# Altium project MC-IMX6UL-DK v1.1.PrjPcb
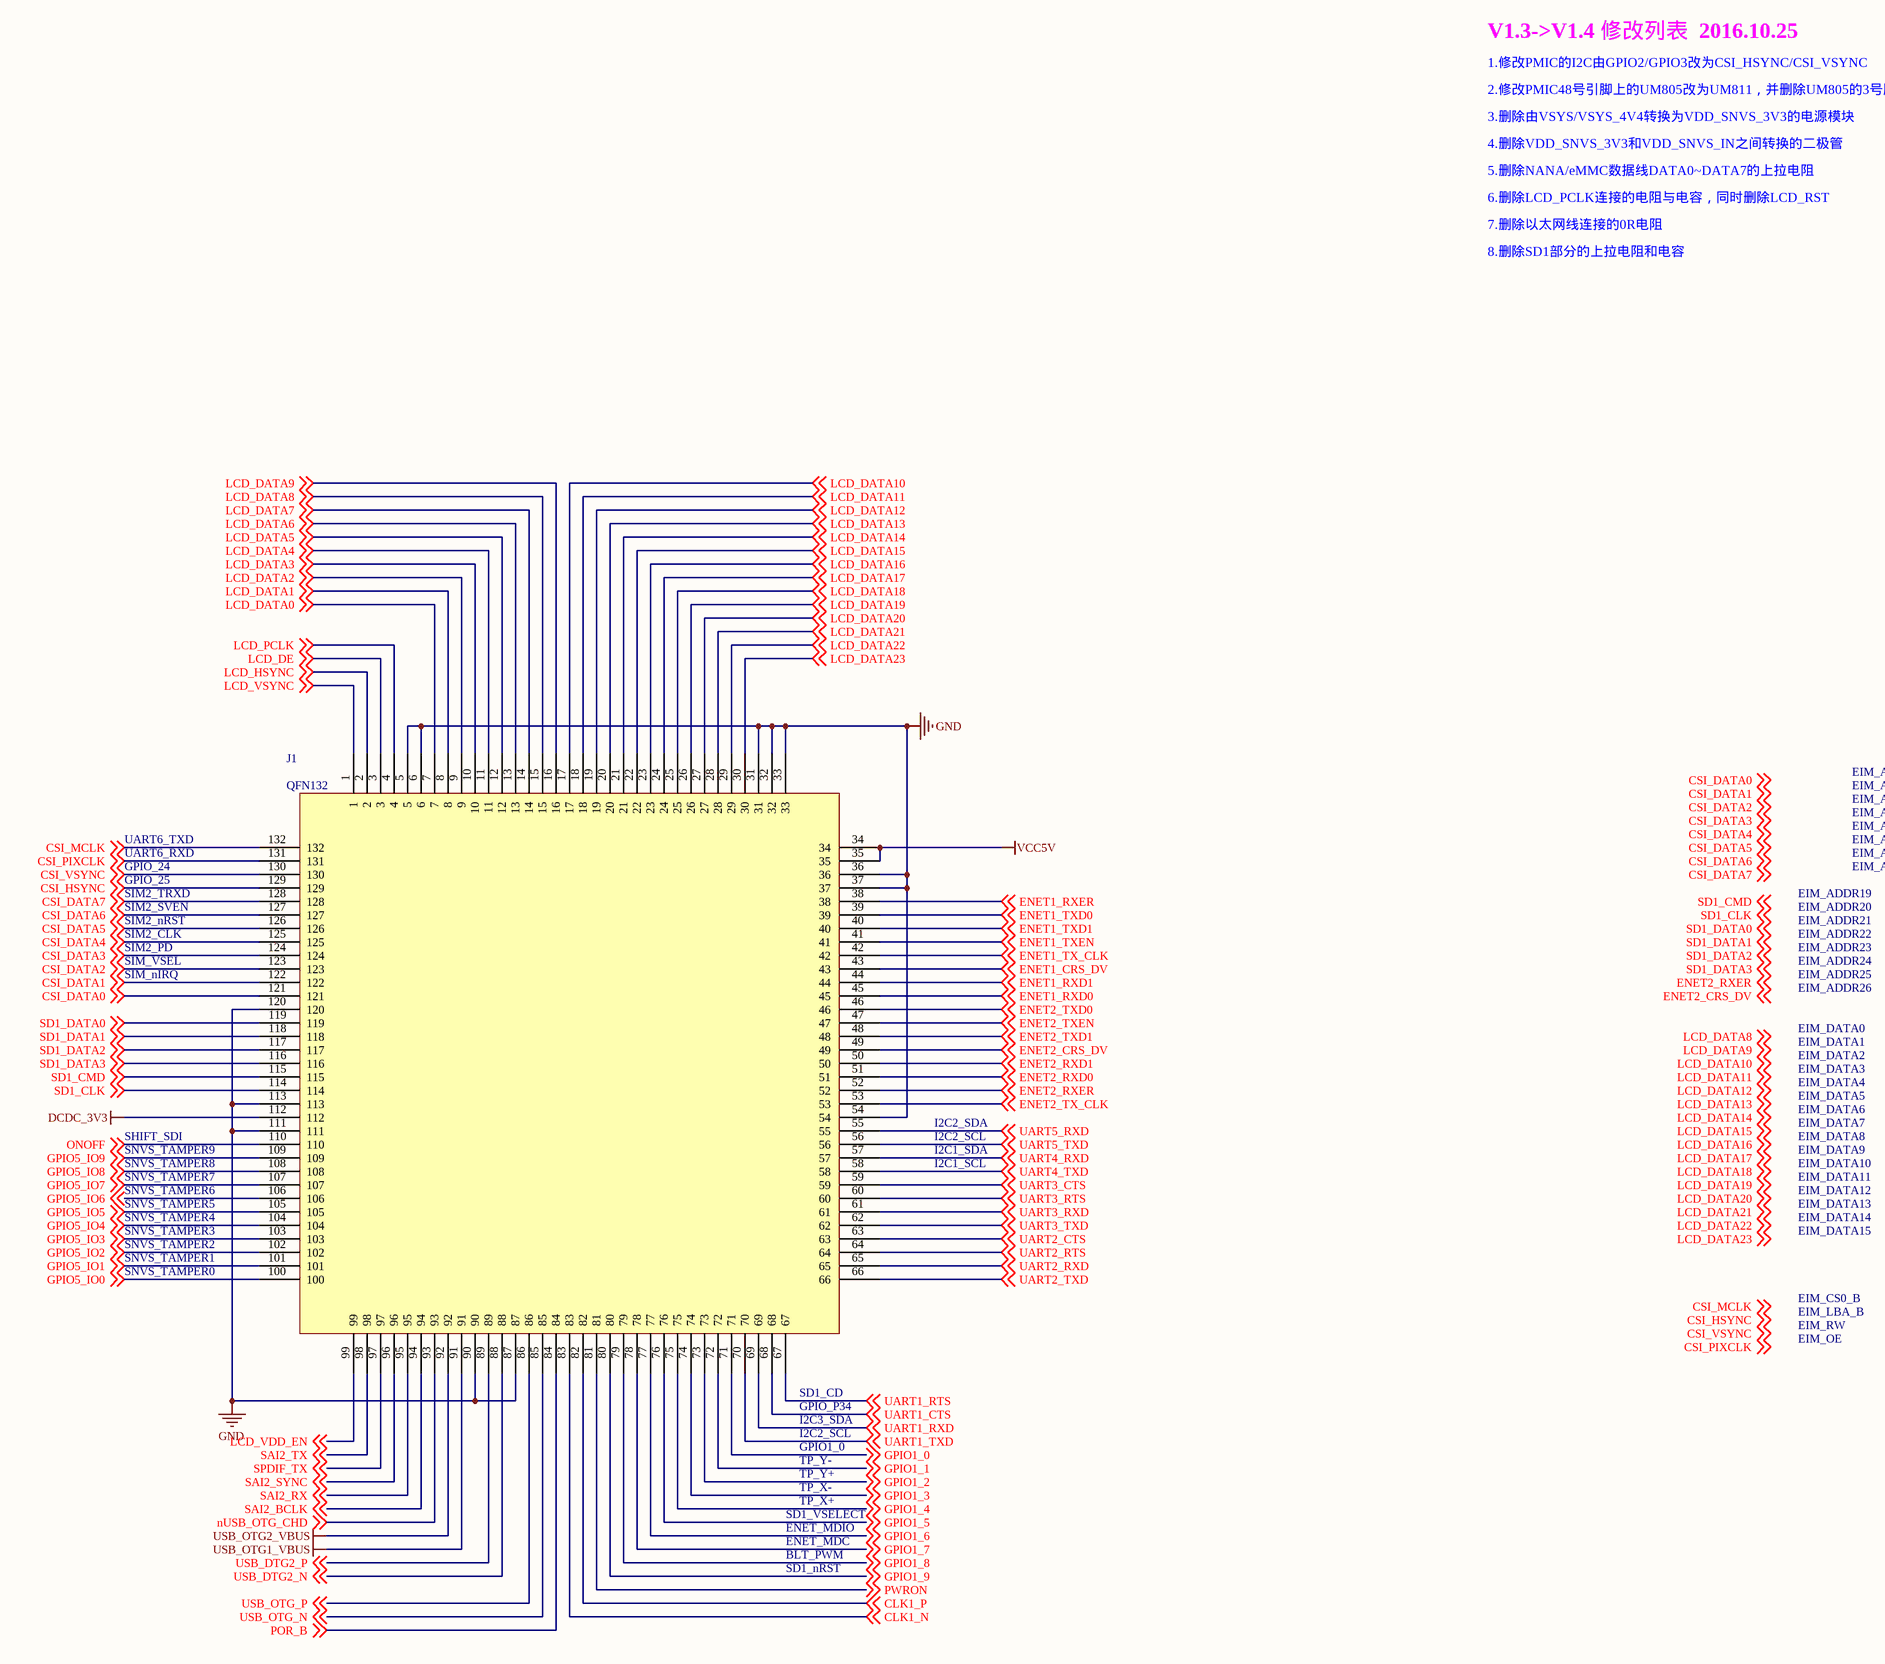
[diagram p0: 1.CONNECTOR.SchDoc]
9 sheets, 328 parts. Net scope: global (net labels, ports and power ports of the same name join across sheets).
Board file: imx6ul.PcbDoc
Sheets:
  1.CONNECTOR.SchDoc
  2.POWER.SchDoc
  3.ETH.SchDoc
  4.CAMERA-RGB.SchDoc
  5.USB-RTC-RST.SchDoc
  6.232-485-CAN-DB.SchDoc
  7.AUDIO-TFCARD.SchDoc
  8.PCIE-WIFI.SchDoc
  9.BOOT.SchDoc

## Sheet 1.CONNECTOR.SchDoc
size 513 x 386 mm

### Parts
J1  QFN132  [YPK33X4]

### Nets
DCDC_3V3: J1.112
GND: J1.5 J1.6 J1.31 J1.32 J1.33 J1.36 J1.37 J1.54 J1.87 J1.90 J1.111 J1.113 J1.120
USB_OTG1_VBUS: J1.91
USB_OTG2_VBUS: J1.92
VCC5V: J1.34 J1.35
CLK1_N: J1.83 ; off-sheet CLK1_N
CLK1_P: J1.82 ; off-sheet CLK1_P
CSI_DATA0: J1.121 ; off-sheet CSI_DATA0
CSI_DATA1: J1.122 ; off-sheet CSI_DATA1
CSI_DATA2: J1.123 ; off-sheet CSI_DATA2
CSI_DATA3: J1.124 ; off-sheet CSI_DATA3
CSI_DATA4: J1.125 ; off-sheet CSI_DATA4
CSI_DATA5: J1.126 ; off-sheet CSI_DATA5
CSI_DATA6: J1.127 ; off-sheet CSI_DATA6
CSI_DATA7: J1.128 ; off-sheet CSI_DATA7
CSI_HSYNC: J1.129 ; off-sheet CSI_HSYNC
CSI_MCLK: J1.132 ; off-sheet CSI_MCLK
CSI_PIXCLK: J1.131 ; off-sheet CSI_PIXCLK
CSI_VSYNC: J1.130 ; off-sheet CSI_VSYNC
ENET1_CRS_DV: J1.43 ; off-sheet ENET1_CRS_DV
ENET1_RXD0: J1.45 ; off-sheet ENET1_RXD0
ENET1_RXD1: J1.44 ; off-sheet ENET1_RXD1
ENET1_RXER: J1.38 ; off-sheet ENET1_RXER
ENET1_TX_CLK: J1.42 ; off-sheet ENET1_TX_CLK
ENET1_TXD0: J1.39 ; off-sheet ENET1_TXD0
ENET1_TXD1: J1.40 ; off-sheet ENET1_TXD1
ENET1_TXEN: J1.41 ; off-sheet ENET1_TXEN
ENET2_CRS_DV: J1.49 ; off-sheet ENET2_CRS_DV
ENET2_RXD0: J1.51 ; off-sheet ENET2_RXD0
ENET2_RXD1: J1.50 ; off-sheet ENET2_RXD1
ENET2_RXER: J1.52 ; off-sheet ENET2_RXER
ENET2_TX_CLK: J1.53 ; off-sheet ENET2_TX_CLK
ENET2_TXD0: J1.46 ; off-sheet ENET2_TXD0
ENET2_TXD1: J1.48 ; off-sheet ENET2_TXD1
ENET2_TXEN: J1.47 ; off-sheet ENET2_TXEN
GPIO1_0: J1.71 ; off-sheet GPIO1_0
GPIO1_1: J1.72 ; off-sheet GPIO1_1
GPIO1_2: J1.73 ; off-sheet GPIO1_2
GPIO1_3: J1.74 ; off-sheet GPIO1_3
GPIO1_4: J1.75 ; off-sheet GPIO1_4
GPIO1_5: J1.76 ; off-sheet GPIO1_5
GPIO1_6: J1.77 ; off-sheet GPIO1_6
GPIO1_7: J1.78 ; off-sheet GPIO1_7
GPIO1_8: J1.79 ; off-sheet GPIO1_8
GPIO1_9: J1.80 ; off-sheet GPIO1_9
GPIO5_IO0: J1.100 ; off-sheet GPIO5_IO0
GPIO5_IO1: J1.101 ; off-sheet GPIO5_IO1
GPIO5_IO2: J1.102 ; off-sheet GPIO5_IO2
GPIO5_IO3: J1.103 ; off-sheet GPIO5_IO3
GPIO5_IO4: J1.104 ; off-sheet GPIO5_IO4
GPIO5_IO5: J1.105 ; off-sheet GPIO5_IO5
GPIO5_IO6: J1.106 ; off-sheet GPIO5_IO6
GPIO5_IO7: J1.107 ; off-sheet GPIO5_IO7
GPIO5_IO8: J1.108 ; off-sheet GPIO5_IO8
GPIO5_IO9: J1.109 ; off-sheet GPIO5_IO9
LCD_DATA0: J1.7 ; off-sheet LCD_DATA0
LCD_DATA1: J1.8 ; off-sheet LCD_DATA1
LCD_DATA2: J1.9 ; off-sheet LCD_DATA2
LCD_DATA3: J1.10 ; off-sheet LCD_DATA3
LCD_DATA4: J1.11 ; off-sheet LCD_DATA4
LCD_DATA5: J1.12 ; off-sheet LCD_DATA5
LCD_DATA6: J1.13 ; off-sheet LCD_DATA6
LCD_DATA7: J1.14 ; off-sheet LCD_DATA7
LCD_DATA8: J1.15 ; off-sheet LCD_DATA8
LCD_DATA9: J1.16 ; off-sheet LCD_DATA9
LCD_DATA10: J1.17 ; off-sheet LCD_DATA10
LCD_DATA11: J1.18 ; off-sheet LCD_DATA11
LCD_DATA12: J1.19 ; off-sheet LCD_DATA12
LCD_DATA13: J1.20 ; off-sheet LCD_DATA13
LCD_DATA14: J1.21 ; off-sheet LCD_DATA14
LCD_DATA15: J1.22 ; off-sheet LCD_DATA15
LCD_DATA16: J1.23 ; off-sheet LCD_DATA16
LCD_DATA17: J1.24 ; off-sheet LCD_DATA17
LCD_DATA18: J1.25 ; off-sheet LCD_DATA18
LCD_DATA19: J1.26 ; off-sheet LCD_DATA19
LCD_DATA20: J1.27 ; off-sheet LCD_DATA20
LCD_DATA21: J1.28 ; off-sheet LCD_DATA21
LCD_DATA22: J1.29 ; off-sheet LCD_DATA22
LCD_DATA23: J1.30 ; off-sheet LCD_DATA23
LCD_DE: J1.3 ; off-sheet LCD_DE
LCD_HSYNC: J1.2 ; off-sheet LCD_HSYNC
LCD_PCLK: J1.4 ; off-sheet LCD_PCLK
LCD_VDD_EN: J1.99 ; off-sheet LCD_VDD_EN
LCD_VSYNC: J1.1 ; off-sheet LCD_VSYNC
nUSB_OTG_CHD: J1.93 ; off-sheet nUSB_OTG_CHD
ONOFF: J1.110 ; off-sheet ONOFF
POR_B: J1.84 ; off-sheet POR_B
PWRON: J1.81 ; off-sheet PWRON
SAI2_BCLK: J1.94 ; off-sheet SAI2_BCLK
SAI2_RX: J1.95 ; off-sheet SAI2_RX
SAI2_SYNC: J1.96 ; off-sheet SAI2_SYNC
SAI2_TX: J1.98 ; off-sheet SAI2_TX
SD1_CLK: J1.114 ; off-sheet SD1_CLK
SD1_CMD: J1.115 ; off-sheet SD1_CMD
SD1_DATA0: J1.119 ; off-sheet SD1_DATA0
SD1_DATA1: J1.118 ; off-sheet SD1_DATA1
SD1_DATA2: J1.117 ; off-sheet SD1_DATA2
SD1_DATA3: J1.116 ; off-sheet SD1_DATA3
SPDIF_TX: J1.97 ; off-sheet SPDIF_TX
UART1_CTS: J1.68 ; off-sheet UART1_CTS
UART1_RTS: J1.67 ; off-sheet UART1_RTS
UART1_RXD: J1.69 ; off-sheet UART1_RXD
UART1_TXD: J1.70 ; off-sheet UART1_TXD
UART2_CTS: J1.63 ; off-sheet UART2_CTS
UART2_RTS: J1.64 ; off-sheet UART2_RTS
UART2_RXD: J1.65 ; off-sheet UART2_RXD
UART2_TXD: J1.66 ; off-sheet UART2_TXD
UART3_CTS: J1.59 ; off-sheet UART3_CTS
UART3_RTS: J1.60 ; off-sheet UART3_RTS
UART3_RXD: J1.61 ; off-sheet UART3_RXD
UART3_TXD: J1.62 ; off-sheet UART3_TXD
UART4_RXD: J1.57 ; off-sheet UART4_RXD
UART4_TXD: J1.58 ; off-sheet UART4_TXD
UART5_RXD: J1.55 ; off-sheet UART5_RXD
UART5_TXD: J1.56 ; off-sheet UART5_TXD
USB_DTG2_N: J1.88 ; off-sheet USB_DTG2_N
USB_DTG2_P: J1.89 ; off-sheet USB_DTG2_P
USB_OTG_N: J1.85 ; off-sheet USB_OTG_N
USB_OTG_P: J1.86 ; off-sheet USB_OTG_P

### Notes on the sheet
- V1.3->V1.4 修改列表  2016.10.25
- 1.修改PMIC的I2C由GPIO2/GPIO3改为CSI_HSYNC/CSI_VSYNC
- 2.修改PMIC48号引脚上的UM805改为UM811，并删除UM805的3号脚的上拉电阻
- 3.删除由VSYS/VSYS_4V4转换为VDD_SNVS_3V3的电源模块
- 4.删除VDD_SNVS_3V3和VDD_SNVS_IN之间转换的二极管
- 5.删除NANA/eMMC数据线DATA0~DATA7的上拉电阻
- 6.删除LCD_PCLK连接的电阻与电容，同时删除LCD_RST
- 7.删除以太网线连接的0R电阻
- 8.删除SD1部分的上拉电阻和电容
- EIM_AD0
- EIM_AD4
- EIM_AD3
- EIM_AD2
- EIM_AD1
- UART6_TXD
- UART6_RXD
- GPIO_24
- GPIO_25
- SIM2_TRXD
- EIM_ADDR19
- EIM_AD7
- EIM_AD6
- EIM_AD5
- SIM_VSEL
- SIM2_PD
- SIM2_CLK
- SIM2_nRST
- SIM2_SVEN
- EIM_ADDR20
- EIM_ADDR21
- EIM_ADDR22
- EIM_ADDR23
- EIM_ADDR24
- SIM_nIRQ
- EIM_ADDR26
- EIM_ADDR25
- EIM_DATA0
- EIM_DATA1
- EIM_DATA2
- EIM_DATA3
- EIM_DATA4
- EIM_DATA5
- SNVS_TAMPER8
- SNVS_TAMPER9
- SHIFT_SDI
- I2C1_SCL
- I2C1_SDA
- I2C2_SCL
- I2C2_SDA
- EIM_DATA6
- EIM_DATA7
- EIM_DATA8
- EIM_DATA9
- EIM_DATA10
- SNVS_TAMPER3
- SNVS_TAMPER4
- SNVS_TAMPER5
- SNVS_TAMPER7
- SNVS_TAMPER6
- EIM_DATA11
- EIM_DATA12
- EIM_DATA13
- EIM_DATA14
- EIM_DATA15
- SNVS_TAMPER0
- SNVS_TAMPER1
- SNVS_TAMPER2
- EIM_CS0_B
- EIM_LBA_B
- EIM_RW
- EIM_OE
- I2C3_SDA
- SD1_CD
- GPIO_P34
- GPIO1_0
- TP_Y-
- TP_Y+
- TP_X-
- TP_X+
- SD1_VSELECT
- ENET_MDIO
- ENET_MDC
- BLT_PWM
- SD1_nRST
- Labels drawn without touching a wire or pin: CSI_DATA0, CSI_DATA1, CSI_DATA2, CSI_DATA3, CSI_DATA4, CSI_DATA5, CSI_DATA6, CSI_DATA7, CSI_HSYNC, CSI_MCLK, CSI_PIXCLK, CSI_VSYNC, ENET2_CRS_DV, ENET2_RXER, LCD_DATA8, LCD_DATA9, LCD_DATA10, LCD_DATA11, LCD_DATA12, LCD_DATA13, LCD_DATA14, LCD_DATA15, LCD_DATA16, LCD_DATA17, LCD_DATA18, LCD_DATA19, LCD_DATA20, LCD_DATA21, LCD_DATA22, LCD_DATA23, SD1_CLK, SD1_CMD, SD1_DATA0, SD1_DATA1, SD1_DATA2, SD1_DATA3

## Sheet 2.POWER.SchDoc: MC-IMX6UL-CORE
size A4; DrawnBy: DrawnBy; DocumentNumber: MC-IMX6UL-CORE; Revision: V1.1; SheetNumber: 2 of 9
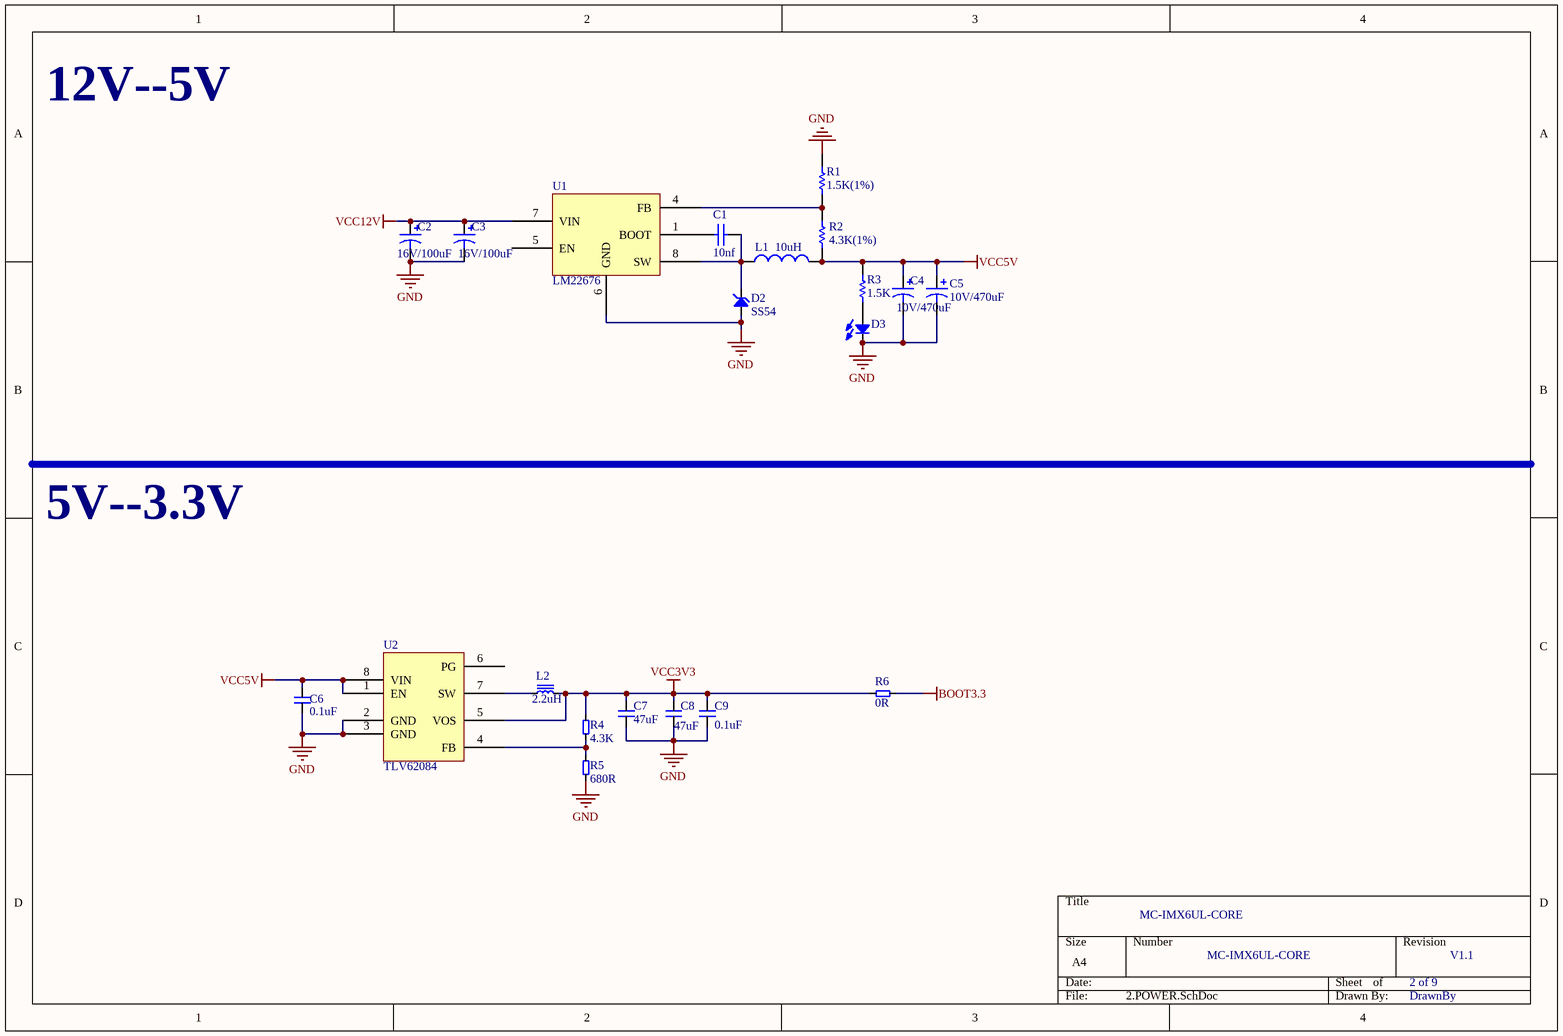
[diagram p1: 2.POWER.SchDoc]

### Parts
(Parts that share a designator on the sheet are numbered #1, #2 ... from top to bottom, then left to right.)
C1#1  value 10nf  [0603C]  (hidden comment: Cap)
C2#1  value 16V/100uF  [C7343]  (hidden comment: Cap Pol3)
C3#1  value 16V/100uF  [C7343]  (hidden comment: Cap Pol3)
C4#1  value 10V/470uF  [C7343]  (hidden comment: Cap Pol3)
C5#1  value 10V/470uF  [C7343]  (hidden comment: Cap Pol3)
C6#1  0.1uF  [0603C]
C7#1  47uF  [C1206]
C8#1  47uF  [C1206]
C9#1  0.1uF  [0603C]
D2  SS54  [SMA]
D3#1  发光二极管  [0603D]  (value not drawn)
L1#1  value 10uH  [L-8040]  (hidden comment: Inductor)
L2#1  2.2uH  [SDRH0420]
R1#1  value 1.5K(1%)  [0603R]  (hidden comment: Res1)
R2#1  value 4.3K(1%)  [0603R]  (hidden comment: Res1)
R3#1  value 1.5K  [0603R]  (hidden comment: Res1)
R4#1  4.3K  [0603R]
R5#1  680R  [0603R]
R6#1  0R  [0603R]
U1#1  LM22676  [SOP8-POW]
U2  TLV62084  [WSON8]

### Nets
BOOT3.3: R6#1.2
GND: C2#1.2 C3#1.2 C4#1.2 C5#1.2 C6#1.2 C7#1.2 C8#1.2 C9#1.2 D2.A D3#1.K R1#1.1 R5#1.1 U1#1.6(GND) U2.2(GND) U2.3(GND)
VCC3V3: C7#1.1 C8#1.1 C9#1.1 L2#1.2 R4#1.2 R6#1.1 U2.5(VOS)
VCC5V: C4#1.1 C5#1.1 C6#1.1 L1#1.2 R2#1.1 R3#1.1 U2.1(EN) U2.8(VIN)
VCC12V: C2#1.1 C3#1.1 U1#1.7(VIN)
NetC1#1_1: C1#1.1 D2.K L1#1.1 U1#1.8(SW)
NetC1#1_2: C1#1.2 U1#1.1(BOOT)
NetD3#1_A: D3#1.A R3#1.2
NetL2#1_1: L2#1.1 U2.7(SW)
NetR1#1_2: R1#1.2 R2#1.2 U1#1.4(FB)
NetR4#1_1: R4#1.1 R5#1.2 U2.4(FB)

Not connected (* = marked no-connect by the designer): U1#1 2(NC) 3(NC) 5(EN); U2 6(PG)

### Notes on the sheet
- 12V--5V
- 5V--3.3V

### Library data of the parts
C1#1 = Cap: Capacitor; Published: 8-Jun-2000; LatestRevisionDate: 17-Jul-2002; LatestRevisionNote: Re-released for DXP Platform.; PackageReference: RAD-0.3; Publisher: Altium Limited
C2#1 C3#1 C4#1 C5#1 = Cap Pol3: Polarized Capacitor (Surface Mount); Published: 8-Jun-2000; LatestRevisionDate: 17-Jul-2002; LatestRevisionNote: Re-released for DXP Platform.; PackageReference: C0805; Publisher: Altium Limited
C6#1 C7#1 C8#1 C9#1 = 电容
D2 = SS24: DIODES: *
L1#1 = Inductor: Code_IEC: 1005; Published: 8-Jun-2000; LatestRevisionDate: 17-Jul-2002; LatestRevisionNote: Re-released for DXP Platform.; PackageReference: 0402-A; Publisher: Altium Limited; Code_JEITA: 0402
L2#1 = 功率电感
R1#1 R2#1 R3#1 = Res1: Resistor; Published: 8-Jun-2000; LatestRevisionDate: 17-Jul-2002; LatestRevisionNote: Re-released for DXP Platform.; PackageReference: AXIAL-0.3; Publisher: Altium Limited
R4#1 R5#1 R6#1 = 电阻
U1#1 = LM22676-5.0

## Sheet 3.ETH.SchDoc: MC-IMX6UL-CORE
size A4; DrawnBy: DrawnBy; DocumentNumber: MC-IMX6UL-CORE; Revision: V1.1; SheetNumber: 3 of 9
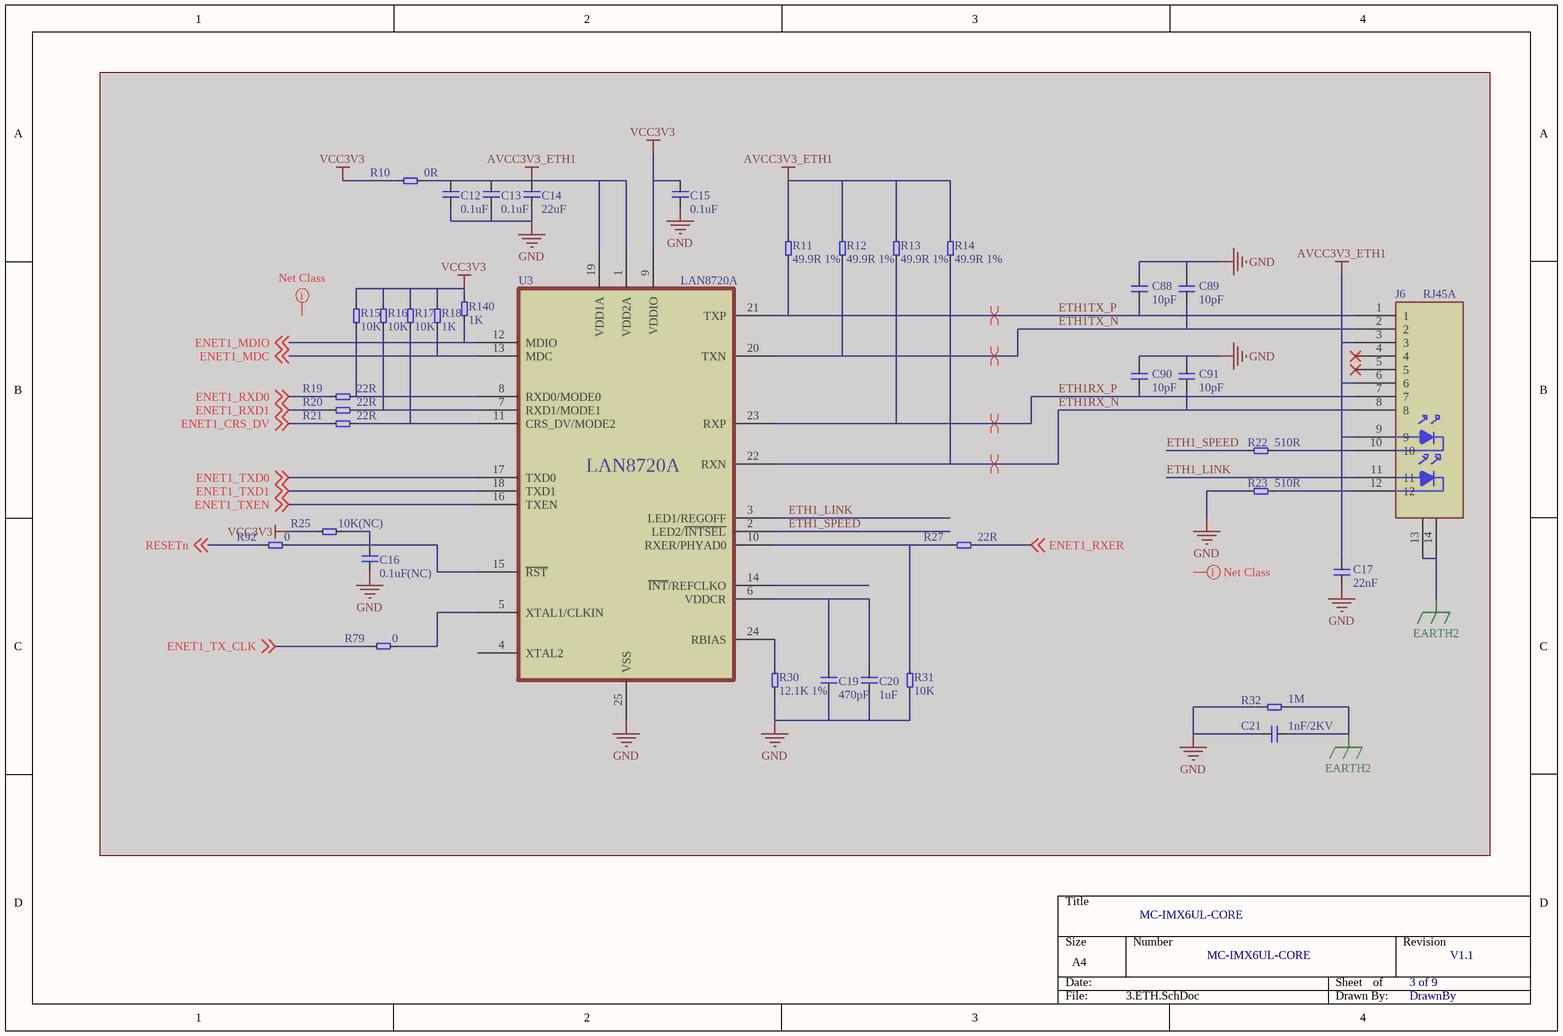
[diagram p2: 3.ETH.SchDoc]

### Parts
C12  0.1uF  [0603C]  (masked out: inside a compile mask, not in the netlist)
C13  0.1uF  [0603C]  (masked out: inside a compile mask, not in the netlist)
C14  22uF  [0805C]  (masked out: inside a compile mask, not in the netlist)
C15  0.1uF  [0603C]  (masked out: inside a compile mask, not in the netlist)
C16  0.1uF(NC)  [0603C]  (masked out: inside a compile mask, not in the netlist)
C17  22nF  [0603C]  (masked out: inside a compile mask, not in the netlist)
C19  470pF  [0603C]  (masked out: inside a compile mask, not in the netlist)
C20  1uF  [0603C]  (masked out: inside a compile mask, not in the netlist)
C21  1nF/2KV  [DC-200]  (masked out: inside a compile mask, not in the netlist)
C88  10pF  [0603C]  (masked out: inside a compile mask, not in the netlist)
C89  10pF  [0603C]  (masked out: inside a compile mask, not in the netlist)
C90  10pF  [0603C]  (masked out: inside a compile mask, not in the netlist)
C91  10pF  [0603C]  (masked out: inside a compile mask, not in the netlist)
J6  RJ45A  [RJ45B-13F-60LDNL]  (masked out: inside a compile mask, not in the netlist)
R10  0R  [0603R]  (masked out: inside a compile mask, not in the netlist)
R11  49.9R 1%  [0603R]  (masked out: inside a compile mask, not in the netlist)
R12  49.9R 1%  [0603R]  (masked out: inside a compile mask, not in the netlist)
R13  49.9R 1%  [0603R]  (masked out: inside a compile mask, not in the netlist)
R14  49.9R 1%  [0603R]  (masked out: inside a compile mask, not in the netlist)
R15  10K  [0603R]  (masked out: inside a compile mask, not in the netlist)
R16  10K  [0603R]  (masked out: inside a compile mask, not in the netlist)
R17  10K  [0603R]  (masked out: inside a compile mask, not in the netlist)
R18  1K  [0603R]  (masked out: inside a compile mask, not in the netlist)
R19  22R  [0603R]  (masked out: inside a compile mask, not in the netlist)
R20  22R  [0603R]  (masked out: inside a compile mask, not in the netlist)
R21  22R  [0603R]  (masked out: inside a compile mask, not in the netlist)
R22  510R  [0603R]  (masked out: inside a compile mask, not in the netlist)
R23  510R  [0603R]  (masked out: inside a compile mask, not in the netlist)
R25  10K(NC)  [0603R]  (masked out: inside a compile mask, not in the netlist)
R27  22R  [0603R]  (masked out: inside a compile mask, not in the netlist)
R30  12.1K 1%  [0603R]  (masked out: inside a compile mask, not in the netlist)
R31  10K  [0603R]  (masked out: inside a compile mask, not in the netlist)
R32  1M  [1206R]  (masked out: inside a compile mask, not in the netlist)
R79  0  [0603R]  (masked out: inside a compile mask, not in the netlist)
R92  0  [0603R]  (masked out: inside a compile mask, not in the netlist)
R140  1K  [0603R]  (masked out: inside a compile mask, not in the netlist)
U3  LAN8720A  [QFN24]  (masked out: inside a compile mask, not in the netlist)

### Layout directives
differential pair: (no net found under the mark)
net class ETH0: (no net found under the mark)

### Library data of the parts
C12-C17 C19-C21 C88-C91 = 电容
R10-R23 R25 R27 R30-R32 R79 R92 R140 = 电阻

## Sheet 4.CAMERA-RGB.SchDoc: MC-IMX6UL-CORE
size A4; DrawnBy: DrawnBy; DocumentNumber: MC-IMX6UL-CORE; Revision: V1.1; SheetNumber: 4 of 9
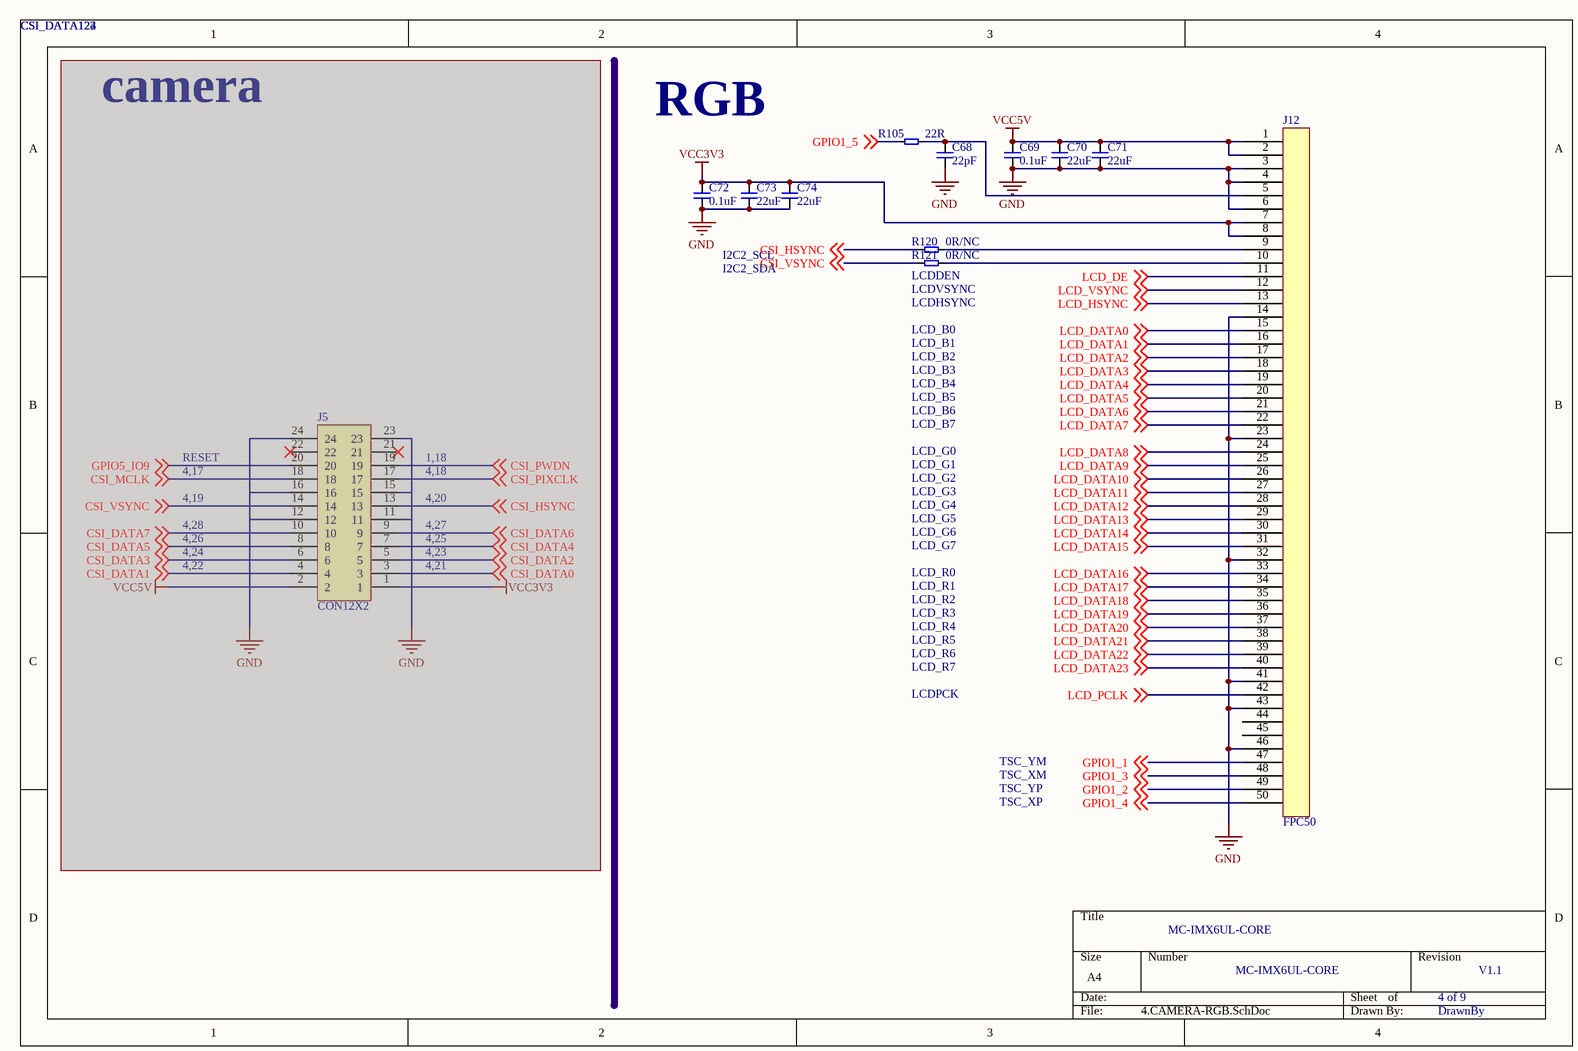
[diagram p3: 4.CAMERA-RGB.SchDoc]

### Parts
C68  22pF  [0603C]
C69  0.1uF  [0603C]
C70  22uF  [0805C]
C71  22uF  [0805C]
C72  0.1uF  [0603C]
C73  22uF  [0805C]
C74  22uF  [0805C]
J5  CON12X2  [IDC12X2-2.54MM]  (masked out: inside a compile mask, not in the netlist)
J12  FPC50  [FPC50-0.5-UP]
R105  22R  [0603R]
R120  0R/NC  [0603R]
R121  0R/NC  [0603R]

### Nets
GND: C68.2 C69.2 C70.1 C71.1 C72.2 C73.1 C74.1 J12.3 J12.4 J12.6 J12.14 J12.23 J12.32 J12.41 J12.43 J12.46
VCC3V3: C72.1 C73.2 C74.2 J12.7 J12.8
VCC5V: C69.1 C70.2 C71.2 J12.1 J12.2
CSI_HSYNC: R120.2 ; off-sheet CSI_HSYNC
CSI_VSYNC: R121.2 ; off-sheet CSI_VSYNC
GPIO1_1: J12.47 ; off-sheet GPIO1_1
GPIO1_2: J12.49 ; off-sheet GPIO1_2
GPIO1_3: J12.48 ; off-sheet GPIO1_3
GPIO1_4: J12.50 ; off-sheet GPIO1_4
GPIO1_5: R105.1 ; off-sheet GPIO1_5
LCD_DATA0: J12.15 ; off-sheet LCD_DATA0
LCD_DATA1: J12.16 ; off-sheet LCD_DATA1
LCD_DATA2: J12.17 ; off-sheet LCD_DATA2
LCD_DATA3: J12.18 ; off-sheet LCD_DATA3
LCD_DATA4: J12.19 ; off-sheet LCD_DATA4
LCD_DATA5: J12.20 ; off-sheet LCD_DATA5
LCD_DATA6: J12.21 ; off-sheet LCD_DATA6
LCD_DATA7: J12.22 ; off-sheet LCD_DATA7
LCD_DATA8: J12.24 ; off-sheet LCD_DATA8
LCD_DATA9: J12.25 ; off-sheet LCD_DATA9
LCD_DATA10: J12.26 ; off-sheet LCD_DATA10
LCD_DATA11: J12.27 ; off-sheet LCD_DATA11
LCD_DATA12: J12.28 ; off-sheet LCD_DATA12
LCD_DATA13: J12.29 ; off-sheet LCD_DATA13
LCD_DATA14: J12.30 ; off-sheet LCD_DATA14
LCD_DATA15: J12.31 ; off-sheet LCD_DATA15
LCD_DATA16: J12.33 ; off-sheet LCD_DATA16
LCD_DATA17: J12.34 ; off-sheet LCD_DATA17
LCD_DATA18: J12.35 ; off-sheet LCD_DATA18
LCD_DATA19: J12.36 ; off-sheet LCD_DATA19
LCD_DATA20: J12.37 ; off-sheet LCD_DATA20
LCD_DATA21: J12.38 ; off-sheet LCD_DATA21
LCD_DATA22: J12.39 ; off-sheet LCD_DATA22
LCD_DATA23: J12.40 ; off-sheet LCD_DATA23
LCD_DE: J12.11 ; off-sheet LCD_DE
LCD_HSYNC: J12.13 ; off-sheet LCD_HSYNC
LCD_PCLK: J12.42 ; off-sheet LCD_PCLK
LCD_VSYNC: J12.12 ; off-sheet LCD_VSYNC
NetC68_1: C68.1 J12.5 R105.2
NetJ12_9: J12.9 R120.1
NetJ12_10: J12.10 R121.1

Not connected (* = marked no-connect by the designer): J12 44 45

### Notes on the sheet
- CSI_DATA122
- CSI_DATA123
- CSI_DATA124
- camera
- RGB
- I2C2_SCL
- I2C2_SDA
- (near R121) LCDDEN
- LCDVSYNC
- LCDHSYNC
- LCD_B0
- LCD_B1
- LCD_B2
- LCD_B3
- LCD_B4
- LCD_B5
- RESET
- 1,18
- LCD_G0
- LCD_B6
- LCD_B7
- 4,17
- 4,19
- 4,28
- 4,20
- 4,18
- 4,27
- LCD_G1
- LCD_G2
- LCD_G3
- LCD_G4
- LCD_G5
- LCD_G6
- 4,22
- 4,24
- 4,26
- 4,21
- 4,23
- 4,25
- LCD_R0
- LCD_R1
- LCD_G7
- LCD_R2
- LCD_R3
- LCD_R4
- LCD_R5
- LCD_R6
- LCD_R7
- LCDPCK
- TSC_YM
- TSC_XM
- TSC_YP
- TSC_XP

### Library data of the parts
C68-C74 = 电容
J12 = FPC50: FPC CONNECTOR
R105 R120 R121 = 电阻

## Sheet 5.USB-RTC-RST.SchDoc: MC-IMX6UL-CORE
size A3; DrawnBy: DrawnBy; DocumentNumber: MC-IMX6UL-CORE; Revision: V1.1; SheetNumber: 5 of 9
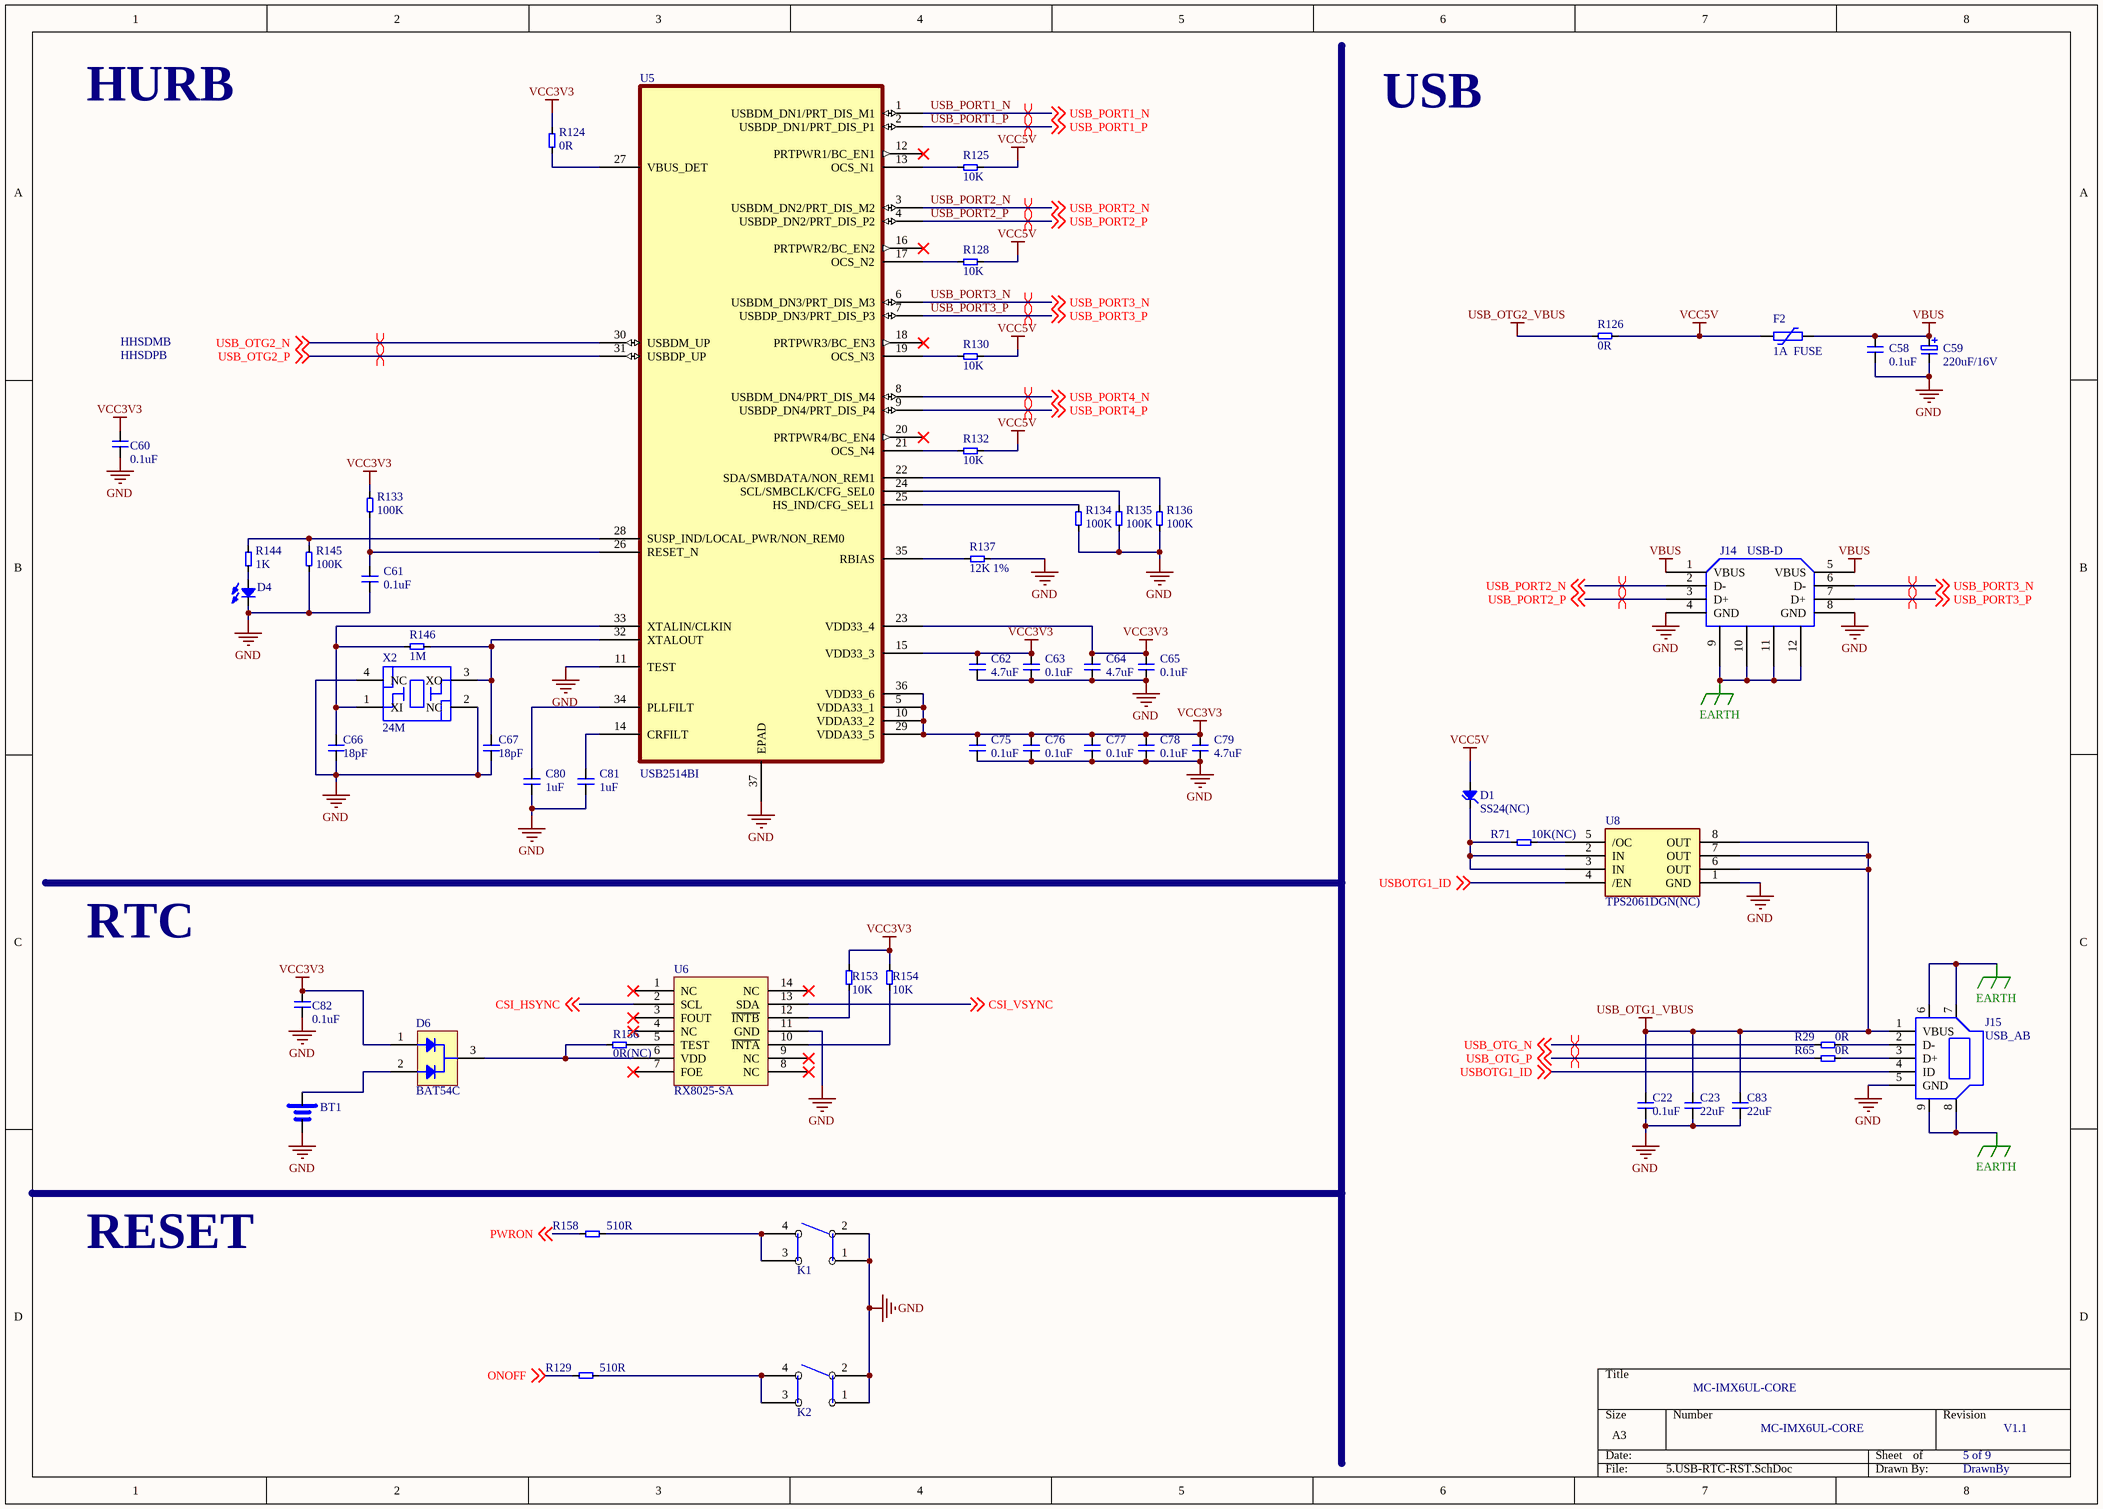
[diagram p4: 5.USB-RTC-RST.SchDoc]

### Parts
BT1  (no value)  [CR1220]
C22  0.1uF  [0603C]
C23  22uF  [0805C]
C58  0.1uF  [0603C]
C59  220uF/16V  [RAD-3/6]
C60  0.1uF  [0603C]
C61  0.1uF  [0603C]
C62  4.7uF  [0603C]
C63  0.1uF  [0603C]
C64  4.7uF  [0603C]
C65  0.1uF  [0603C]
C66  18pF  [0603C]
C67  18pF  [0603C]
C75  0.1uF  [0603C]
C76  0.1uF  [0603C]
C77  0.1uF  [0603C]
C78  0.1uF  [0603C]
C79  4.7uF  [0603C]
C80  1uF  [0603C]
C81  1uF  [0603C]
C82  0.1uF  [0603C]
C83  22uF  [0805C]
D1  SS24(NC)  [SMA]
D4  发光二极管  [0603D]  (value not drawn)
D6  BAT54C  [SOT-23]
F2  1A  FUSE  [1812F]
J14  USB-D  [USB-D]
J15  USB_AB  [USB-AB]
K1  按键  [SS-SPB-4.5]  (value not drawn)
K2  按键  [SS-SPB-4.5]  (value not drawn)
R29  0R  [0603R]
R65  0R  [0603R]
R71  10K(NC)  [0603R]
R124  0R  [0603R]
R125  10K  [0603R]
R126  0R  [0603R]
R128  10K  [0603R]
R129  510R  [0603R]
R130  10K  [0603R]
R132  10K  [0603R]
R133  100K  [0603R]
R134  100K  [0603R]
R135  100K  [0603R]
R136  100K  [0603R]
R137  12K 1%  [0603R]
R144  1K  [0603R]
R145  100K  [0603R]
R146  1M  [0603R]
R153  10K  [0603R]
R154  10K  [0603R]
R156  0R(NC)  [0603R]
R158  510R  [0603R]
U5  USB2514BI  [QFN-36]
U6  RX8025-SA  [SOP14-1.27]
U8  TPS2061DGN(NC)  [MSOP-8]
X2  24M  [OSC4-3225]

### Nets
EARTH: J14.9 J14.10 J14.11 J14.12 J15.6(GND) J15.7(GND) J15.8(GND) J15.9(GND)
GND: BT1.2 C22.1 C23.1 C58.1 C59.2 C60.1 C61.1 C62.1 C63.1 C64.1 C65.1 C66.1 C67.1 C75.1 C76.1 C77.1 C78.1 C79.1 C80.1 C81.1 C82.1 C83.1 D4.K J14.4(GND) J14.8(GND) J15.5(GND) K1.1 K1.2 K2.1 K2.2 R134.2 R135.2 R136.2 R137.1 R145.2 U5.11(TEST) U5.37(EPAD) U6.11(GND) U8.1(GND) X2.2(NC) X2.4(NC)
USB_OTG1_VBUS: C22.2 C23.2 C83.2 J15.1(VBUS) U8.6(OUT) U8.7(OUT) U8.8(OUT)
USB_OTG2_VBUS: R126.2
VBUS: C58.2 C59.1 F2.2 J14.1(VBUS) J14.5(VBUS)
VCC3V3: C60.2 C62.2 C63.2 C64.2 C65.2 C75.2 C76.2 C77.2 C78.2 C79.2 C82.2 D6.1 R124.2 R133.1 R153.2 R154.2 U5.5(VDDA33_1) U5.10(VDDA33_2) U5.15(VDD33_3) U5.23(VDD33_4) U5.29(VDDA33_5) U5.36(VDD33_6)
VCC5V: D1.A F2.1 R125.1 R126.1 R128.1 R130.1 R132.1
CSI_HSYNC: U6.2(SCL) ; off-sheet CSI_HSYNC
CSI_VSYNC: U6.13(SDA) ; off-sheet CSI_VSYNC
ONOFF: R129.2 ; off-sheet ONOFF
PWRON: R158.2 ; off-sheet PWRON
USB_OTG2_N: U5.30(USBDM_UP) ; off-sheet USB_OTG2_N
USB_OTG2_P: U5.31(USBDP_UP) ; off-sheet USB_OTG2_P
USB_OTG_N: R29.2 ; off-sheet USB_OTG_N
USB_OTG_P: R65.2 ; off-sheet USB_OTG_P
USB_PORT1_N: U5.1(USBDM_DN1/PRT_DIS_M1) ; off-sheet USB_PORT1_N
USB_PORT1_P: U5.2(USBDP_DN1/PRT_DIS_P1) ; off-sheet USB_PORT1_P
USB_PORT2_N: J14.2(D-) U5.3(USBDM_DN2/PRT_DIS_M2) ; off-sheet USB_PORT2_N
USB_PORT2_P: J14.3(D+) U5.4(USBDP_DN2/PRT_DIS_P2) ; off-sheet USB_PORT2_P
USB_PORT3_N: J14.6(D-) U5.6(USBDM_DN3/PRT_DIS_M3) ; off-sheet USB_PORT3_N
USB_PORT3_P: J14.7(D+) U5.7(USBDP_DN3/PRT_DIS_P3) ; off-sheet USB_PORT3_P
USB_PORT4_N: U5.8(USBDM_DN4/PRT_DIS_M4) ; off-sheet USB_PORT4_N
USB_PORT4_P: U5.9(USBDP_DN4/PRT_DIS_P4) ; off-sheet USB_PORT4_P
USBOTG1_ID: J15.4(ID) U8.4(/EN) ; off-sheet USBOTG1_ID
NetBT1_1: BT1.1 D6.2
NetC61_2: C61.2 R133.2 U5.26(RESET_N)
NetC66_2: C66.2 R146.1 U5.33(XTALIN/CLKIN) X2.1(XI)
NetC67_2: C67.2 R146.2 U5.32(XTALOUT) X2.3(XO)
NetC80_2: C80.2 U5.34(PLLFILT)
NetC81_2: C81.2 U5.14(CRFILT)
NetD1_K: D1.K R71.2 U8.2(IN) U8.3(IN)
NetD4_A: D4.A R144.1
NetD6_3: D6.3 R156.2 U6.6(VDD)
NetJ15_2: J15.2(D-) R29.1
NetJ15_3: J15.3(D+) R65.1
NetK1_3: K1.3 K1.4 R158.1
NetK2_3: K2.3 K2.4 R129.1
NetR71_1: R71.1 U8.5(/OC)
NetR124_1: R124.1 U5.27(VBUS_DET)
NetR125_2: R125.2 U5.13(OCS_N1)
NetR128_2: R128.2 U5.17(OCS_N2)
NetR130_2: R130.2 U5.19(OCS_N3)
NetR132_2: R132.2 U5.21(OCS_N4)
NetR134_1: R134.1 U5.25(HS_IND/CFG_SEL1)
NetR135_1: R135.1 U5.24(SCL/SMBCLK/CFG_SEL0)
NetR136_1: R136.1 U5.22(SDA/SMBDATA/NON_REM1)
NetR137_2: R137.2 U5.35(RBIAS)
NetR144_2: R144.2 R145.1 U5.28(SUSP_IND/LOCAL_PWR/NON_REM0)
NetR153_1: R153.1 U6.12(~{INTB})
NetR154_1: R154.1 U6.10(~{INTA})
NetR156_1: R156.1 U6.5(TEST)

Not connected (* = marked no-connect by the designer): U5 12(PRTPWR1/BC_EN1)* 16(PRTPWR2/BC_EN2)* 18(PRTPWR3/BC_EN3)* 20(PRTPWR4/BC_EN4)*; U6 1(NC)* 3(FOUT)* 4(NC)* 7(FOE)* 8(NC)* 9(NC)* 14(NC)*

### Layout directives
differential pair: USB_OTG2_N, USB_OTG2_P, USB_OTG_N, USB_OTG_P, USB_PORT1_N, USB_PORT1_P, USB_PORT2_N, USB_PORT2_P, USB_PORT3_N, USB_PORT3_P, USB_PORT4_N, USB_PORT4_P

### Notes on the sheet
- HURB
- USB
- HHSDMB
- HHSDPB
- RTC
- RESET

### Library data of the parts
BT1 = 电池
C22 C23 C58 C60-C67 C75-C83 = 电容
C59 = 直插电解电容
D1 = SS24: DIODES: *
D6 = BAT54C: SCHOTTKY DIODE
F2 = FUSE: 贴片自恢复保险丝
J14 = USB-D: USB DOUBLE PORTS
J15 = USB_AB: 小USB插痤
R29 R65 R71 R124-R126 R128-R130 R132-R137 R144-R146 R153 R154 R156 R158 = 电阻
U5 = USB2514
U6 = RX8025-SA: I2C interface RTC with crystal built-in
U8 = TPS2061: TPS2061DGN
X2 = 表贴晶体: 4PIN表贴晶体

## Sheet 6.232-485-CAN-DB.SchDoc: MC-IMX6UL-CORE
size A3; DrawnBy: DrawnBy; DocumentNumber: MC-IMX6UL-CORE; Revision: V1.1; SheetNumber: 6 of 9
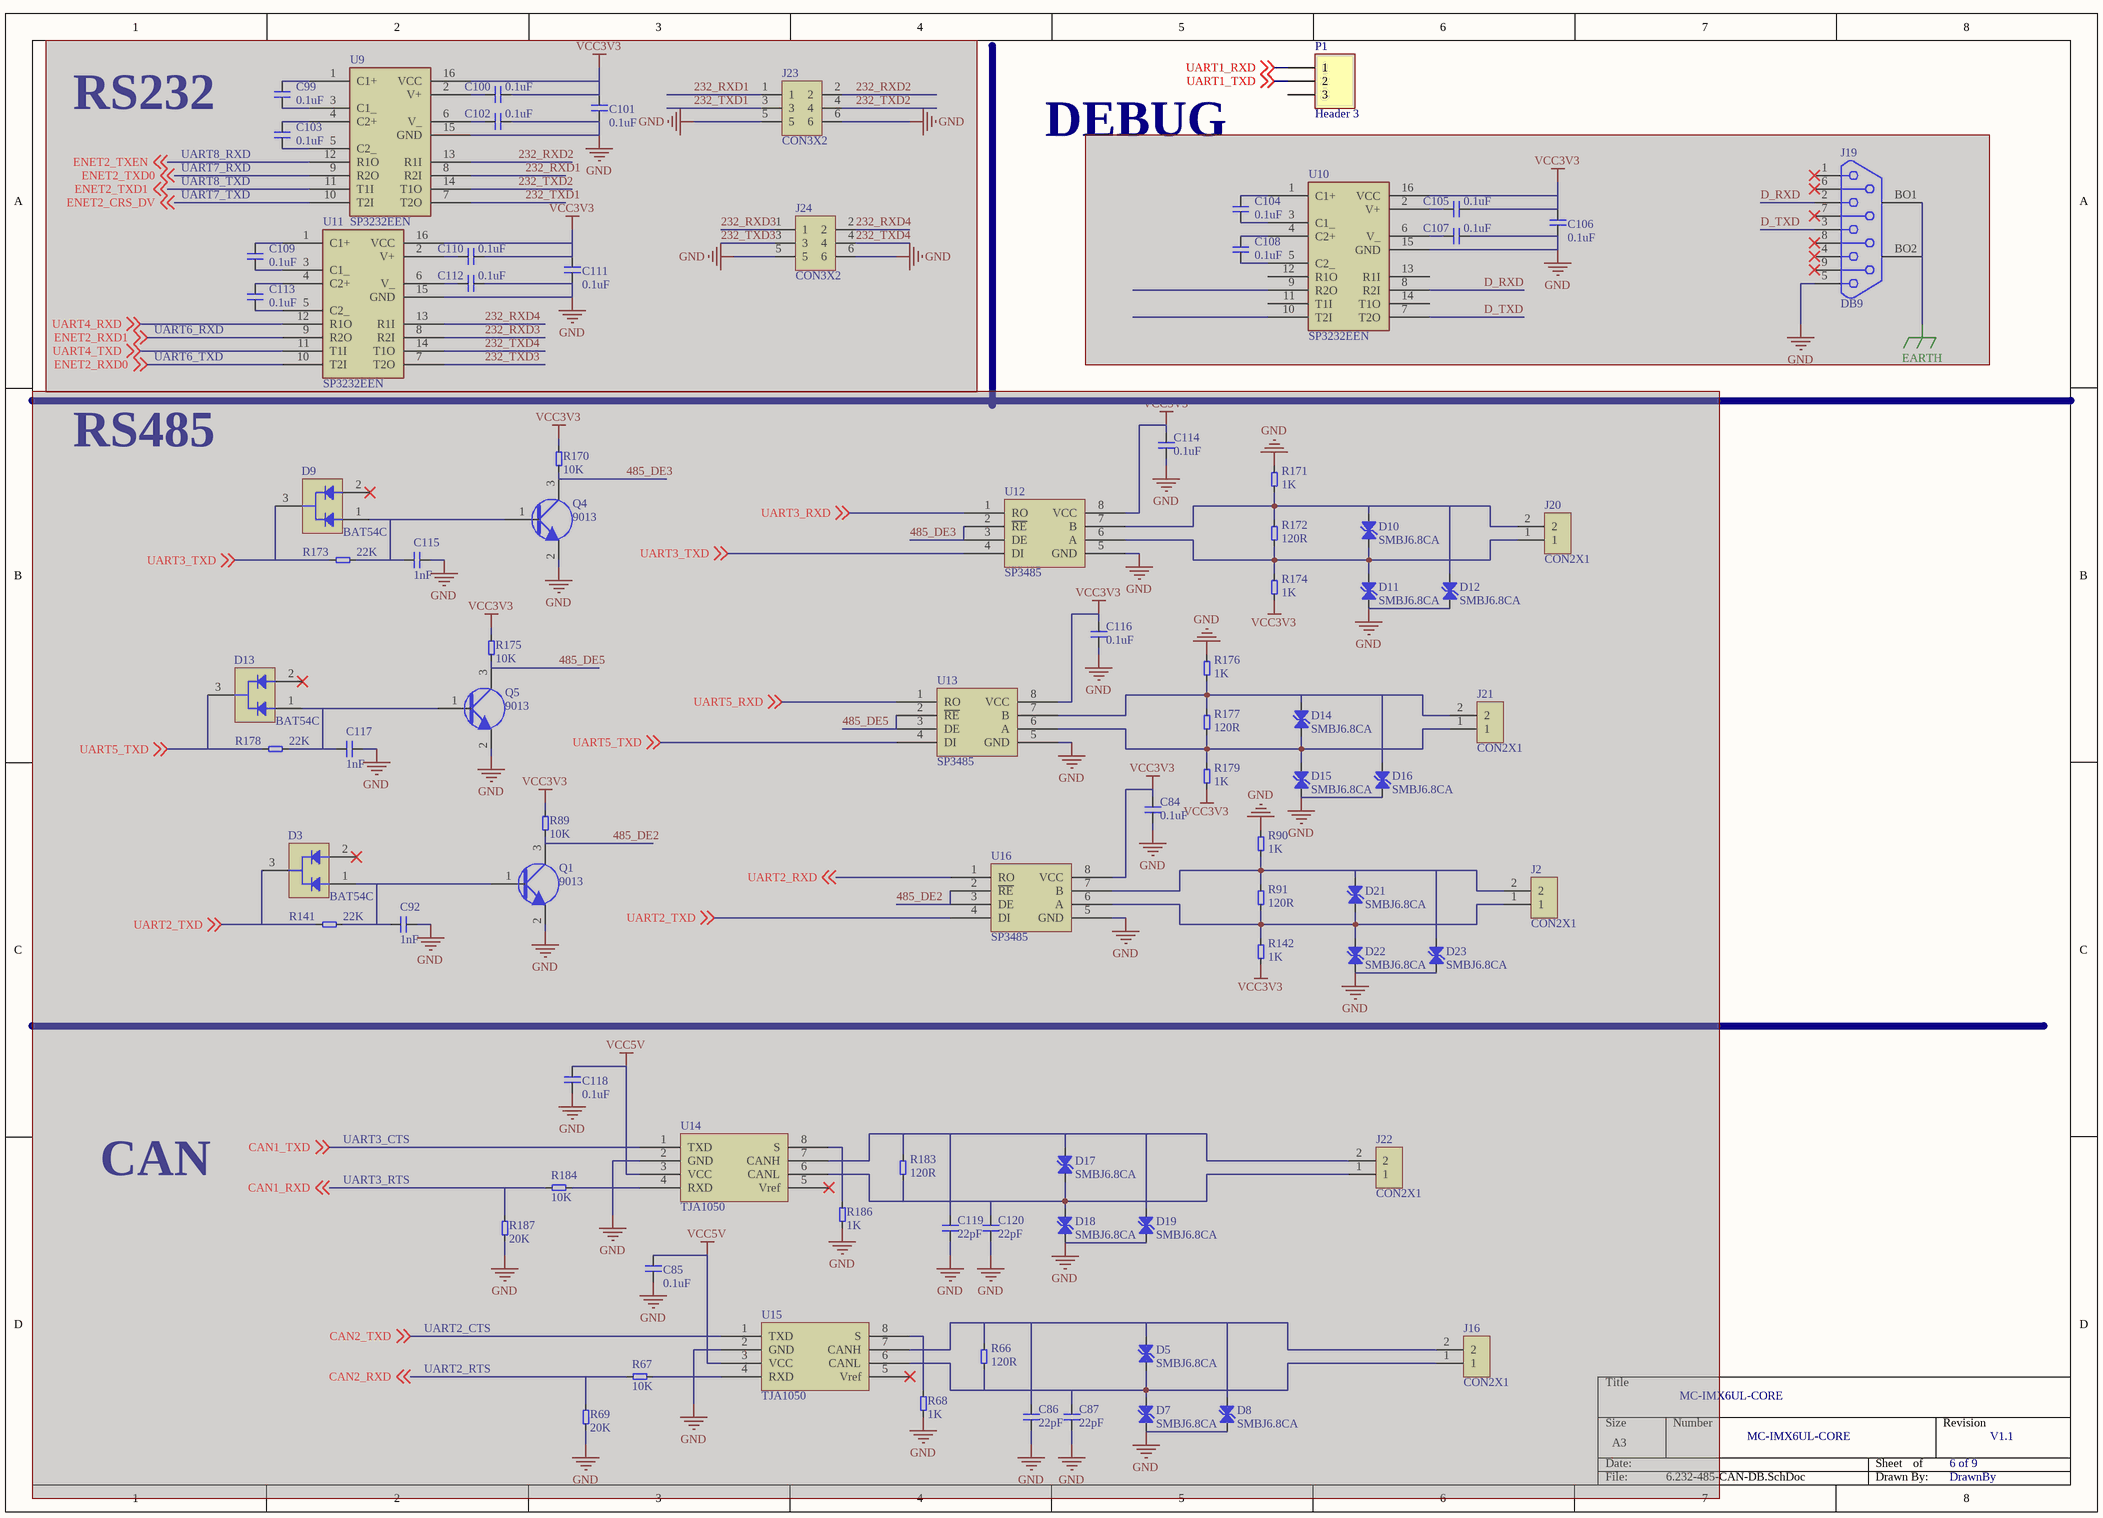
[diagram p5: 6.232-485-CAN-DB.SchDoc]

### Parts
(Parts that share a designator on the sheet are numbered #1, #2 ... from top to bottom, then left to right.)
C84  0.1uF  [0603C]  (masked out: inside a compile mask, not in the netlist)
C85  0.1uF  [0603C]  (masked out: inside a compile mask, not in the netlist)
C86  22pF  [0603C]  (masked out: inside a compile mask, not in the netlist)
C87  22pF  [0603C]  (masked out: inside a compile mask, not in the netlist)
C92  1nF  [0603C]  (masked out: inside a compile mask, not in the netlist)
C99  0.1uF  [0603C]  (masked out: inside a compile mask, not in the netlist)
C100  0.1uF  [0603C]  (masked out: inside a compile mask, not in the netlist)
C101  0.1uF  [0603C]  (masked out: inside a compile mask, not in the netlist)
C102  0.1uF  [0603C]  (masked out: inside a compile mask, not in the netlist)
C103  0.1uF  [0603C]  (masked out: inside a compile mask, not in the netlist)
C104  0.1uF  [0603C]  (masked out: inside a compile mask, not in the netlist)
C105  0.1uF  [0603C]  (masked out: inside a compile mask, not in the netlist)
C106  0.1uF  [0603C]  (masked out: inside a compile mask, not in the netlist)
C107  0.1uF  [0603C]  (masked out: inside a compile mask, not in the netlist)
C108  0.1uF  [0603C]  (masked out: inside a compile mask, not in the netlist)
C109  0.1uF  [0603C]  (masked out: inside a compile mask, not in the netlist)
C110  0.1uF  [0603C]  (masked out: inside a compile mask, not in the netlist)
C111  0.1uF  [0603C]  (masked out: inside a compile mask, not in the netlist)
C112  0.1uF  [0603C]  (masked out: inside a compile mask, not in the netlist)
C113  0.1uF  [0603C]  (masked out: inside a compile mask, not in the netlist)
C114  0.1uF  [0603C]  (masked out: inside a compile mask, not in the netlist)
C115  1nF  [0603C]  (masked out: inside a compile mask, not in the netlist)
C116  0.1uF  [0603C]  (masked out: inside a compile mask, not in the netlist)
C117  1nF  [0603C]  (masked out: inside a compile mask, not in the netlist)
C118  0.1uF  [0603C]  (masked out: inside a compile mask, not in the netlist)
C119  22pF  [0603C]  (masked out: inside a compile mask, not in the netlist)
C120  22pF  [0603C]  (masked out: inside a compile mask, not in the netlist)
D3#2  BAT54C  [SOT-23]  (masked out: inside a compile mask, not in the netlist)
D5  SMBJ6.8CA  [SMBJ]  (masked out: inside a compile mask, not in the netlist)
D7  SMBJ6.8CA  [SMBJ]  (masked out: inside a compile mask, not in the netlist)
D8  SMBJ6.8CA  [SMBJ]  (masked out: inside a compile mask, not in the netlist)
D9  BAT54C  [SOT-23]  (masked out: inside a compile mask, not in the netlist)
D10  SMBJ6.8CA  [SMBJ]  (masked out: inside a compile mask, not in the netlist)
D11  SMBJ6.8CA  [SMBJ]  (masked out: inside a compile mask, not in the netlist)
D12  SMBJ6.8CA  [SMBJ]  (masked out: inside a compile mask, not in the netlist)
D13  BAT54C  [SOT-23]  (masked out: inside a compile mask, not in the netlist)
D14  SMBJ6.8CA  [SMBJ]  (masked out: inside a compile mask, not in the netlist)
D15  SMBJ6.8CA  [SMBJ]  (masked out: inside a compile mask, not in the netlist)
D16  SMBJ6.8CA  [SMBJ]  (masked out: inside a compile mask, not in the netlist)
D17  SMBJ6.8CA  [SMBJ]  (masked out: inside a compile mask, not in the netlist)
D18  SMBJ6.8CA  [SMBJ]  (masked out: inside a compile mask, not in the netlist)
D19  SMBJ6.8CA  [SMBJ]  (masked out: inside a compile mask, not in the netlist)
D21  SMBJ6.8CA  [SMBJ]  (masked out: inside a compile mask, not in the netlist)
D22  SMBJ6.8CA  [SMBJ]  (masked out: inside a compile mask, not in the netlist)
D23  SMBJ6.8CA  [SMBJ]  (masked out: inside a compile mask, not in the netlist)
J2  CON2X1  [IDC2X1 3.81]  (masked out: inside a compile mask, not in the netlist)
J16  CON2X1  [IDC2X1 3.81]  (masked out: inside a compile mask, not in the netlist)
J19  DB9  [DB-9/M]  (masked out: inside a compile mask, not in the netlist)
J20  CON2X1  [IDC2X1 3.81]  (masked out: inside a compile mask, not in the netlist)
J21  CON2X1  [IDC2X1 3.81]  (masked out: inside a compile mask, not in the netlist)
J22  CON2X1  [IDC2X1 3.81]  (masked out: inside a compile mask, not in the netlist)
J23  CON3X2  [IDC3X2-2.54MM]  (masked out: inside a compile mask, not in the netlist)
J24  CON3X2  [IDC3X2-2.54MM]  (masked out: inside a compile mask, not in the netlist)
P1  Header 3  [HDR1X3]
Q1  9013  [SOT-23]  (masked out: inside a compile mask, not in the netlist)
Q4  9013  [SOT-23]  (masked out: inside a compile mask, not in the netlist)
Q5  9013  [SOT-23]  (masked out: inside a compile mask, not in the netlist)
R66  120R  [0603R]  (masked out: inside a compile mask, not in the netlist)
R67  10K  [0603R]  (masked out: inside a compile mask, not in the netlist)
R68  1K  [0603R]  (masked out: inside a compile mask, not in the netlist)
R69  20K  [0603R]  (masked out: inside a compile mask, not in the netlist)
R89  10K  [0603R]  (masked out: inside a compile mask, not in the netlist)
R90  1K  [0603R]  (masked out: inside a compile mask, not in the netlist)
R91  120R  [0603R]  (masked out: inside a compile mask, not in the netlist)
R141  22K  [0603R]  (masked out: inside a compile mask, not in the netlist)
R142  1K  [0603R]  (masked out: inside a compile mask, not in the netlist)
R170  10K  [0603R]  (masked out: inside a compile mask, not in the netlist)
R171  1K  [0603R]  (masked out: inside a compile mask, not in the netlist)
R172  120R  [0603R]  (masked out: inside a compile mask, not in the netlist)
R173  22K  [0603R]  (masked out: inside a compile mask, not in the netlist)
R174  1K  [0603R]  (masked out: inside a compile mask, not in the netlist)
R175  10K  [0603R]  (masked out: inside a compile mask, not in the netlist)
R176  1K  [0603R]  (masked out: inside a compile mask, not in the netlist)
R177  120R  [0603R]  (masked out: inside a compile mask, not in the netlist)
R178  22K  [0603R]  (masked out: inside a compile mask, not in the netlist)
R179  1K  [0603R]  (masked out: inside a compile mask, not in the netlist)
R183  120R  [0603R]  (masked out: inside a compile mask, not in the netlist)
R184  10K  [0603R]  (masked out: inside a compile mask, not in the netlist)
R186  1K  [0603R]  (masked out: inside a compile mask, not in the netlist)
R187  20K  [0603R]  (masked out: inside a compile mask, not in the netlist)
U9  SP3232EEN  [SOIC16-1.27]  (masked out: inside a compile mask, not in the netlist)
U10  SP3232EEN  [SOIC16-1.27]  (masked out: inside a compile mask, not in the netlist)
U11  SP3232EEN  [SOIC16-1.27]  (masked out: inside a compile mask, not in the netlist)
U12  SP3485  [SOP8-1.27]  (masked out: inside a compile mask, not in the netlist)
U13  SP3485  [SOP8-1.27]  (masked out: inside a compile mask, not in the netlist)
U14  TJA1050  [SOP8-1.27]  (masked out: inside a compile mask, not in the netlist)
U15  TJA1050  [SOP8-1.27]  (masked out: inside a compile mask, not in the netlist)
U16  SP3485  [SOP8-1.27]  (masked out: inside a compile mask, not in the netlist)

### Nets
UART1_RXD: P1.1 ; off-sheet UART1_RXD
UART1_TXD: P1.2 ; off-sheet UART1_TXD

Not connected (* = marked no-connect by the designer): P1 3

### Notes on the sheet
- RS232
- UART8_TXD
- UART8_RXD
- UART7_RXD
- DEBUG
- UART7_TXD
- UART6_TXD
- UART6_RXD
- RS485
- CAN
- UART3_CTS
- UART3_RTS
- UART2_CTS
- UART2_RTS

### Library data of the parts
C84-C87 C92 C99-C120 = 电容
D3#2 D9 D13 = BAT54C: SCHOTTKY DIODE
D5 D7 D8 D10-D12 D14-D19 D21-D23 = P6KE
J2 J16 J20-J22 = Component_1
P1 = Header 3: Header, 3-Pin; LatestRevisionDate: 17-Jul-2002; LatestRevisionNote: Re-released for DXP Platform.; Publisher: Altium Limited
R66-R69 R89-R91 R141 R142 R170-R179 R183 R184 R186 R187 = 电阻
U9-U11 = MAX232ESE: Text Field1: MAXIM; Text Field2: RS232; MAXIM: *
U12 U13 U16 = MAX485ESA: MAXIM: *

## Sheet 7.AUDIO-TFCARD.SchDoc: MC-IMX6UL-CORE
size A3; DrawnBy: DrawnBy; DocumentNumber: MC-IMX6UL-CORE; Revision: V1.1; SheetNumber: 7 of 9
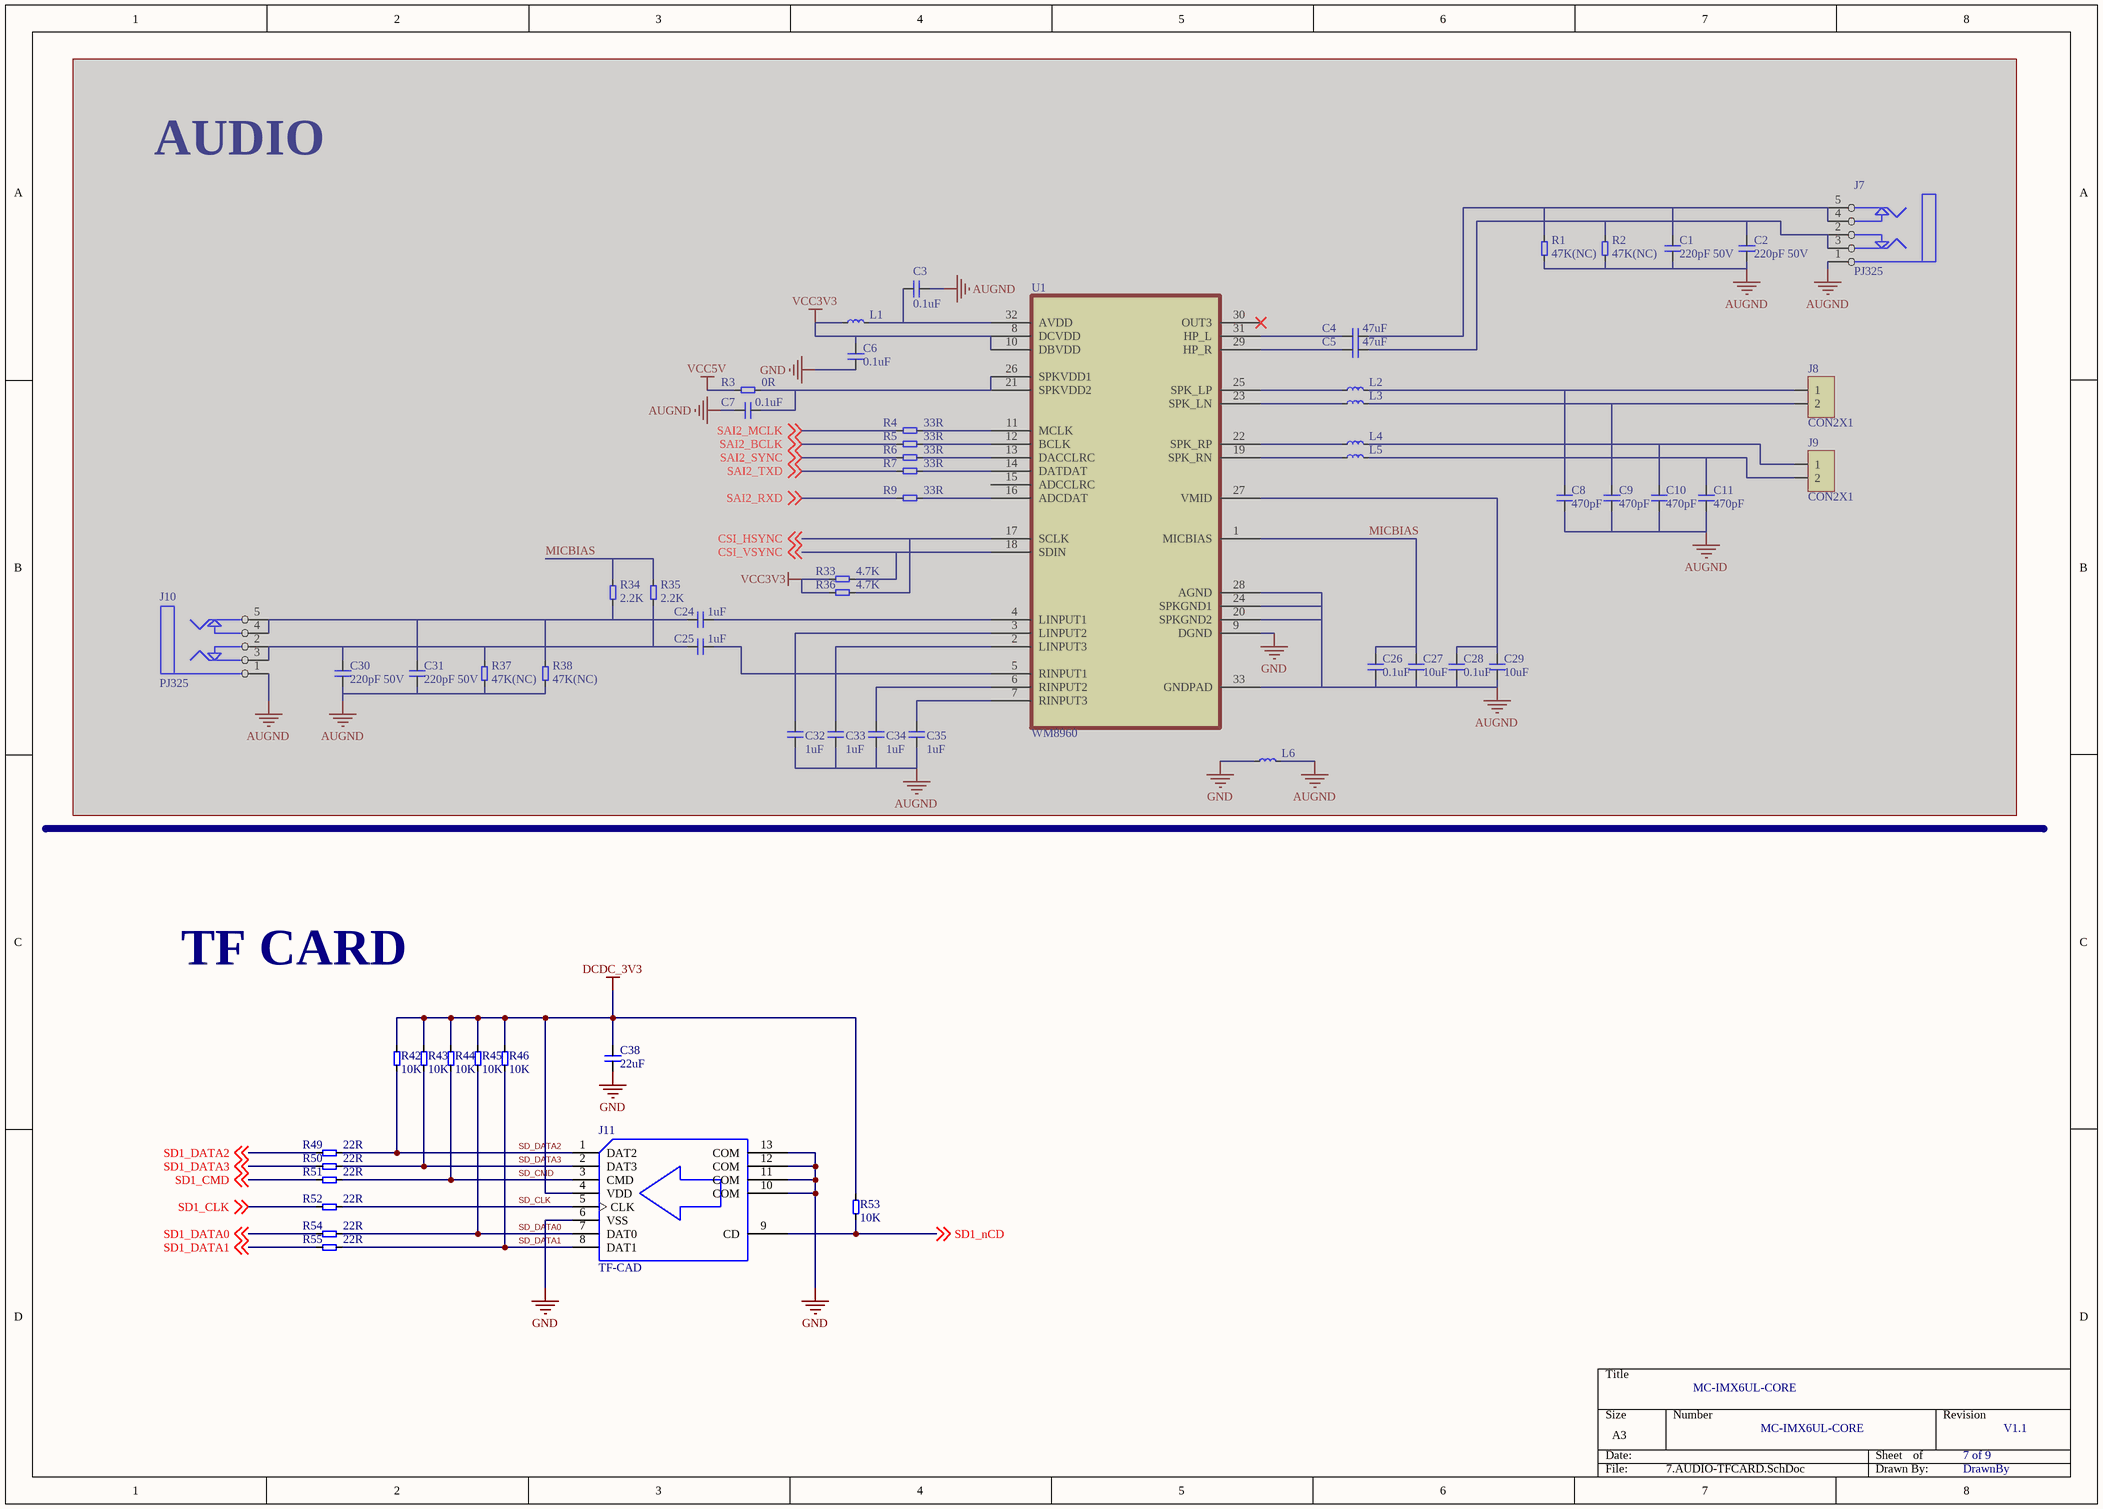
[diagram p6: 7.AUDIO-TFCARD.SchDoc]

### Parts
(Parts that share a designator on the sheet are numbered #1, #2 ... from top to bottom, then left to right.)
C1#2  220pF 50V  [0603C]  (masked out: inside a compile mask, not in the netlist)
C2#2  220pF 50V  [0603C]  (masked out: inside a compile mask, not in the netlist)
C3#2  0.1uF  [0603C]  (masked out: inside a compile mask, not in the netlist)
C4#2  47uF  [1206C]  (masked out: inside a compile mask, not in the netlist)
C5#2  47uF  [1206C]  (masked out: inside a compile mask, not in the netlist)
C6#2  0.1uF  [0603C]  (masked out: inside a compile mask, not in the netlist)
C7#2  0.1uF  [0603C]  (masked out: inside a compile mask, not in the netlist)
C8#2  470pF  [0603C]  (masked out: inside a compile mask, not in the netlist)
C9#2  470pF  [0603C]  (masked out: inside a compile mask, not in the netlist)
C10  470pF  [0603C]  (masked out: inside a compile mask, not in the netlist)
C11  470pF  [0603C]  (masked out: inside a compile mask, not in the netlist)
C24  1uF  [0603C]  (masked out: inside a compile mask, not in the netlist)
C25  1uF  [0603C]  (masked out: inside a compile mask, not in the netlist)
C26  0.1uF  [0603C]  (masked out: inside a compile mask, not in the netlist)
C27  10uF  [0805C]  (masked out: inside a compile mask, not in the netlist)
C28  0.1uF  [0603C]  (masked out: inside a compile mask, not in the netlist)
C29  10uF  [0805C]  (masked out: inside a compile mask, not in the netlist)
C30  220pF 50V  [0603C]  (masked out: inside a compile mask, not in the netlist)
C31  220pF 50V  [0603C]  (masked out: inside a compile mask, not in the netlist)
C32  1uF  [0603C]  (masked out: inside a compile mask, not in the netlist)
C33  1uF  [0603C]  (masked out: inside a compile mask, not in the netlist)
C34  1uF  [0603C]  (masked out: inside a compile mask, not in the netlist)
C35  1uF  [0603C]  (masked out: inside a compile mask, not in the netlist)
C38  22uF  [0805C]
J7  PJ325  [PJ325]  (masked out: inside a compile mask, not in the netlist)
J8  CON2X1  [IDC2X1-2.54MM-W]  (masked out: inside a compile mask, not in the netlist)
J9  CON2X1  [IDC2X1-2.54MM-W]  (masked out: inside a compile mask, not in the netlist)
J10  PJ325  [PJ325]  (masked out: inside a compile mask, not in the netlist)
J11  TF-CAD  [TF-CARD]
L1#2  电感  [0603L]  (value not drawn)  (masked out: inside a compile mask, not in the netlist)
L2#2  电感  [0603L]  (value not drawn)  (masked out: inside a compile mask, not in the netlist)
L3  电感  [0603L]  (value not drawn)  (masked out: inside a compile mask, not in the netlist)
L4  电感  [0603L]  (value not drawn)  (masked out: inside a compile mask, not in the netlist)
L5  电感  [0603L]  (value not drawn)  (masked out: inside a compile mask, not in the netlist)
L6  电感  [0603L]  (value not drawn)  (masked out: inside a compile mask, not in the netlist)
R1#2  47K(NC)  [0603R]  (masked out: inside a compile mask, not in the netlist)
R2#2  47K(NC)  [0603R]  (masked out: inside a compile mask, not in the netlist)
R3#2  0R  [0603R]  (masked out: inside a compile mask, not in the netlist)
R4#2  33R  [0603R]  (masked out: inside a compile mask, not in the netlist)
R5#2  33R  [0603R]  (masked out: inside a compile mask, not in the netlist)
R6#2  33R  [0603R]  (masked out: inside a compile mask, not in the netlist)
R7#1  33R  [0603R]  (masked out: inside a compile mask, not in the netlist)
R9  33R  [0603R]  (masked out: inside a compile mask, not in the netlist)
R33  4.7K  [0603R]  (masked out: inside a compile mask, not in the netlist)
R34  2.2K  [0603R]  (masked out: inside a compile mask, not in the netlist)
R35  2.2K  [0603R]  (masked out: inside a compile mask, not in the netlist)
R36  4.7K  [0603R]  (masked out: inside a compile mask, not in the netlist)
R37  47K(NC)  [0603R]  (masked out: inside a compile mask, not in the netlist)
R38  47K(NC)  [0603R]  (masked out: inside a compile mask, not in the netlist)
R42  10K  [0603R]
R43  10K  [0603R]
R44  10K  [0603R]
R45  10K  [0603R]
R46  10K  [0603R]
R49  22R  [0603R]
R50  22R  [0603R]
R51  22R  [0603R]
R52  22R  [0603R]
R53  10K  [0603R]
R54  22R  [0603R]
R55  22R  [0603R]
U1#2  WM8960  [QFN-32]  (masked out: inside a compile mask, not in the netlist)

### Nets
DCDC_3V3: C38.2 J11.4(VDD) R42.2 R43.2 R44.2 R45.2 R46.2 R53.2
GND: C38.1 J11.6(VSS) J11.10(COM) J11.11(COM) J11.12(COM) J11.13(COM)
SD1_CLK: R52.1 ; off-sheet SD1_CLK
SD1_CMD: R51.1 ; off-sheet SD1_CMD
SD1_DATA0: R54.1 ; off-sheet SD1_DATA0
SD1_DATA1: R55.1 ; off-sheet SD1_DATA1
SD1_DATA2: R49.1 ; off-sheet SD1_DATA2
SD1_DATA3: R50.1 ; off-sheet SD1_DATA3
SD1_nCD: J11.9(CD) R53.1 ; off-sheet SD1_nCD
SD_CLK: J11.5(CLK) R52.2
SD_CMD: J11.3(CMD) R44.1 R51.2
SD_DATA0: J11.7(DAT0) R45.1 R54.2
SD_DATA1: J11.8(DAT1) R46.1 R55.2
SD_DATA2: J11.1(DAT2) R42.1 R49.2
SD_DATA3: J11.2(DAT3) R43.1 R50.2

### Notes on the sheet
- AUDIO
- TF CARD

### Library data of the parts
C1#2 C2#2 C3#2 C4#2 C5#2 C6#2 C7#2 C8#2 C9#2 C10 C11 C24-C35 C38 = 电容
R1#2 R2#2 R3#2 R4#2 R5#2 R6#2 R7#1 R9 R33-R38 R42-R46 R49-R55 = 电阻

## Sheet 8.PCIE-WIFI.SchDoc: MC-IMX6UL-CORE
size A4; DrawnBy: DrawnBy; DocumentNumber: MC-IMX6UL-CORE; Revision: V1.1; SheetNumber: 8 of 9
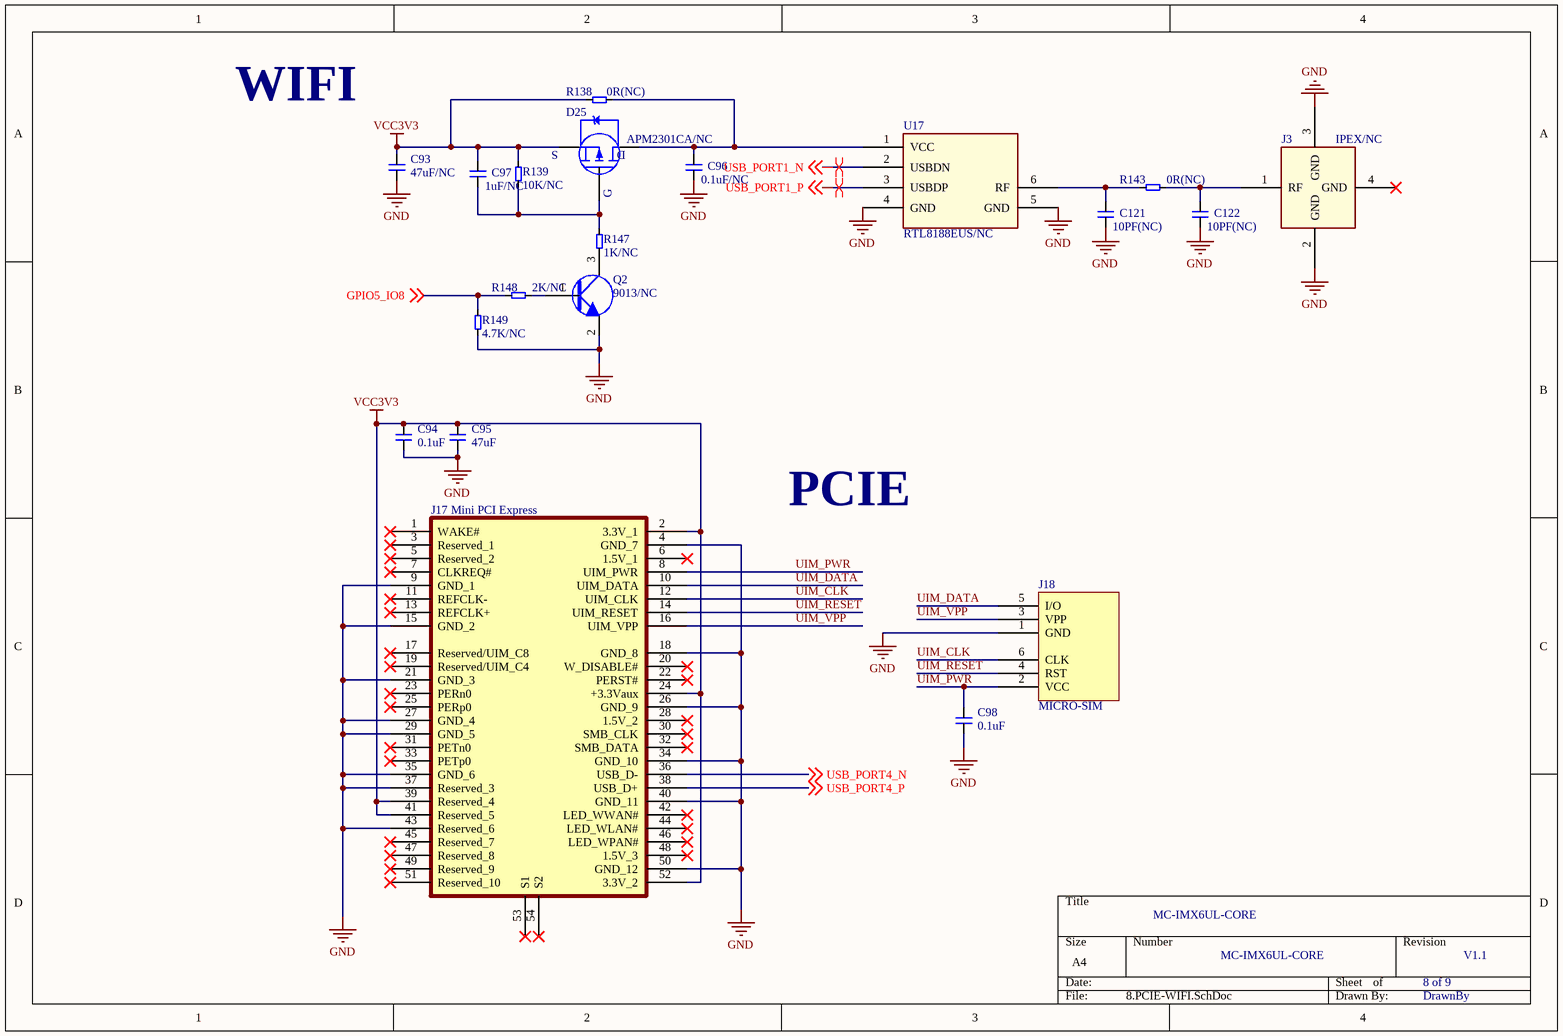
[diagram p7: 8.PCIE-WIFI.SchDoc]

### Parts
C93  47uF/NC  [1206C]
C94  0.1uF  [0603C]
C95  47uF  [1206C]
C96  0.1uF/NC  [0603C]
C97  1uF/NC  [0603C]
C98  0.1uF  [0603C]
C121  10PF(NC)  [0402C]
C122  10PF(NC)  [0402C]
D25  APM2301CA/NC  [SOT-23]
J3  IPEX/NC  [IPEX]
J17  Mini PCI Express  [MINI-PCIE]
J18  MICRO-SIM  [MACRO-SIM]
Q2  9013/NC  [SOT-23]
R138  0R(NC)  [0603R]
R139  10K/NC  [0603R]
R143  0R(NC)  [0402R]
R147  1K/NC  [0603R]
R148  2K/NC  [0603R]
R149  4.7K/NC  [0603R]
U17  RTL8188EUS/NC  [RTL8188EUS 13*12.2]

### Nets
GND: C93.2 C94.2 C95.2 C96.2 C98.2 C121.2 C122.2 J3.2(GND) J3.3(GND) J17.4(GND_7) J17.9(GND_1) J17.15(GND_2) J17.18(GND_8) J17.21(GND_3) J17.26(GND_9) J17.27(GND_4) J17.29(GND_5) J17.34(GND_10) J17.35(GND_6) J17.37(Reserved_3) J17.40(GND_11) J17.43(Reserved_6) J17.50(GND_12) J18.1(GND) Q2.2 R149.2 U17.4(GND) U17.5(GND)
VCC3V3: C93.1 C94.1 C95.1 C97.1 D25.2 J17.2(3.3V_1) J17.24(+3.3Vaux) J17.39(Reserved_4) J17.41(Reserved_5) J17.52(3.3V_2) R138.2 R139.2
GPIO5_IO8: R148.1 R149.1 ; off-sheet GPIO5_IO8
UIM_CLK: J17.12(UIM_CLK) J18.6(CLK)
UIM_DATA: J17.10(UIM_DATA) J18.5(I/O)
UIM_PWR: C98.1 J17.8(UIM_PWR) J18.2(VCC)
UIM_RESET: J17.14(UIM_RESET) J18.4(RST)
UIM_VPP: J17.16(UIM_VPP) J18.3(VPP)
USB_PORT1_N: U17.2(USBDN) ; off-sheet USB_PORT1_N
USB_PORT1_P: U17.3(USBDP) ; off-sheet USB_PORT1_P
USB_PORT4_N: J17.36(USB_D-) ; off-sheet USB_PORT4_N
USB_PORT4_P: J17.38(USB_D+) ; off-sheet USB_PORT4_P
NetC96_1: C96.1 D25.3 R138.1 U17.1(VCC)
NetC97_2: C97.2 D25.1 R139.1 R147.2
NetC121_1: C121.1 R143.1 U17.6(RF)
NetC122_1: C122.1 J3.1(RF) R143.2
NetQ2_1: Q2.1 R148.2
NetQ2_3: Q2.3 R147.1

Not connected (* = marked no-connect by the designer): J3 4(GND)*; J17 1(WAKE#)* 3(Reserved_1)* 5(Reserved_2)* 6(1.5V_1)* 7(CLKREQ#)* 11(REFCLK-)* 13(REFCLK+)* 17(Reserved/UIM_C8)* 19(Reserved/UIM_C4)* 20(W_DISABLE#)* 22(PERST#)* 23(PERn0)* 25(PERp0)* 28(1.5V_2)* 30(SMB_CLK)* 31(PETn0)* 32(SMB_DATA)* 33(PETp0)* 42(LED_WWAN#)* 44(LED_WLAN#)* 45(Reserved_7)* 46(LED_WPAN#)* 47(Reserved_8)* 48(1.5V_3)* 49(Reserved_9)* 51(Reserved_10)* 53(S1)* 54(S2)*

### Layout directives
differential pair: USB_PORT1_N, USB_PORT1_P

### Notes on the sheet
- WIFI
- PCIE
- (in symbol APM2301CA) S; D; G

### Library data of the parts
C93-C98 C121 C122 = 电容
D25 = APM2301CA
J3 = IPEX
J17 = MINIPCIE: MPC24-52K3311
Q2 = 9013
R138 R139 R143 R147-R149 = 电阻
U17 = RTL8188EUS-13*12.2

## Sheet 9.BOOT.SchDoc: MC-IMX6UL-CORE
size A4; DrawnBy: DrawnBy; DocumentNumber: MC-IMX6UL-CORE; Revision: V1.1; SheetNumber: 9 of 9
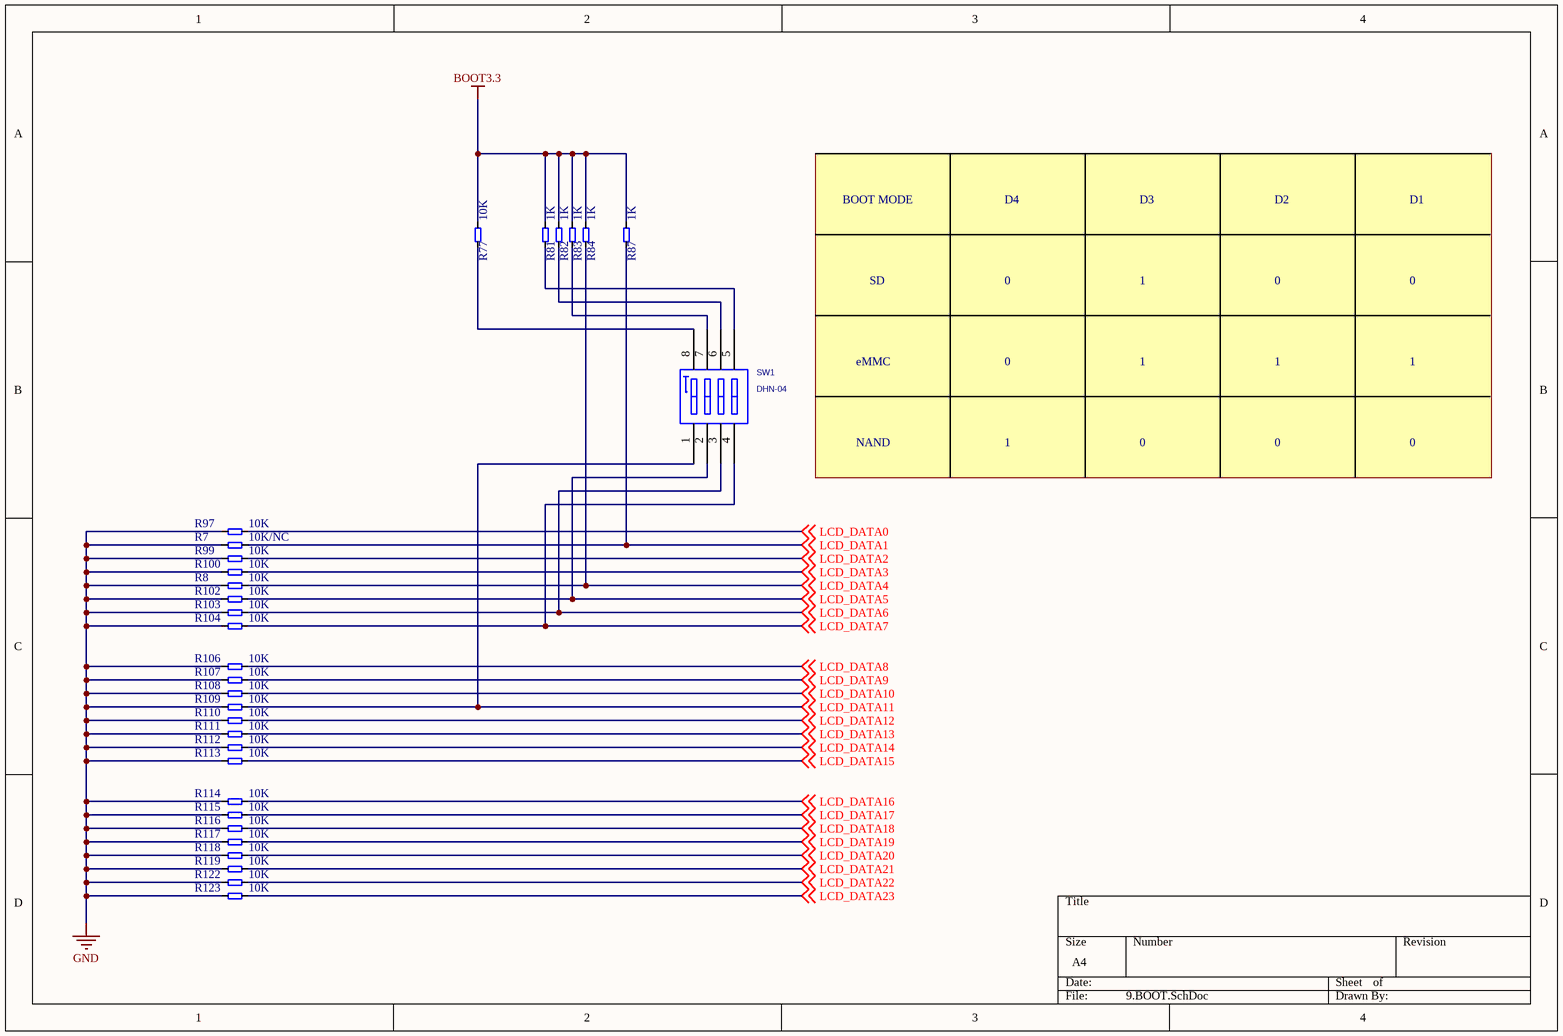
[diagram p8: 9.BOOT.SchDoc]

### Parts
(Parts that share a designator on the sheet are numbered #1, #2 ... from top to bottom, then left to right.)
R7#2  10K/NC  [0603R]
R8  10K  [0603R]
R77  10K  [0603R]
R81  1K  [0603R]
R82  1K  [0603R]
R83  1K  [0603R]
R84  1K  [0603R]
R87  1K  [0603R]
R97  10K  [0603R]
R99  10K  [0603R]
R100  10K  [0603R]
R102  10K  [0603R]
R103  10K  [0603R]
R104  10K  [0603R]
R106  10K  [0603R]
R107  10K  [0603R]
R108  10K  [0603R]
R109  10K  [0603R]
R110  10K  [0603R]
R111  10K  [0603R]
R112  10K  [0603R]
R113  10K  [0603R]
R114  10K  [0603R]
R115  10K  [0603R]
R116  10K  [0603R]
R117  10K  [0603R]
R118  10K  [0603R]
R119  10K  [0603R]
R122  10K  [0603R]
R123  10K  [0603R]
SW1  DHN-04  [SW-4P]

### Nets
BOOT3.3: R77.2 R81.2 R82.2 R83.2 R84.2 R87.2
GND: R7#2.1 R8.1 R97.1 R99.1 R100.1 R102.1 R103.1 R104.1 R106.1 R107.1 R108.1 R109.1 R110.1 R111.1 R112.1 R113.1 R114.1 R115.1 R116.1 R117.1 R118.1 R119.1 R122.1 R123.1
LCD_DATA0: R97.2 ; off-sheet LCD_DATA0
LCD_DATA1: R7#2.2 R87.1 ; off-sheet LCD_DATA1
LCD_DATA2: R99.2 ; off-sheet LCD_DATA2
LCD_DATA3: R100.2 ; off-sheet LCD_DATA3
LCD_DATA4: R8.2 R84.1 ; off-sheet LCD_DATA4
LCD_DATA5: R102.2 SW1.2(A2) ; off-sheet LCD_DATA5
LCD_DATA6: R103.2 SW1.3(A3) ; off-sheet LCD_DATA6
LCD_DATA7: R104.2 SW1.4(A4) ; off-sheet LCD_DATA7
LCD_DATA8: R106.2 ; off-sheet LCD_DATA8
LCD_DATA9: R107.2 ; off-sheet LCD_DATA9
LCD_DATA10: R108.2 ; off-sheet LCD_DATA10
LCD_DATA11: R109.2 SW1.1(A1) ; off-sheet LCD_DATA11
LCD_DATA12: R110.2 ; off-sheet LCD_DATA12
LCD_DATA13: R111.2 ; off-sheet LCD_DATA13
LCD_DATA14: R112.2 ; off-sheet LCD_DATA14
LCD_DATA15: R113.2 ; off-sheet LCD_DATA15
LCD_DATA16: R114.2 ; off-sheet LCD_DATA16
LCD_DATA17: R115.2 ; off-sheet LCD_DATA17
LCD_DATA18: R116.2 ; off-sheet LCD_DATA18
LCD_DATA19: R117.2 ; off-sheet LCD_DATA19
LCD_DATA20: R118.2 ; off-sheet LCD_DATA20
LCD_DATA21: R119.2 ; off-sheet LCD_DATA21
LCD_DATA22: R122.2 ; off-sheet LCD_DATA22
LCD_DATA23: R123.2 ; off-sheet LCD_DATA23
NetR77_1: R77.1 SW1.8(B1)
NetR81_1: R81.1 SW1.5(B4)
NetR82_1: R82.1 SW1.6(B3)
NetR83_1: R83.1 SW1.7(B2)

### Notes on the sheet
- BOOT MODE
- D4
- D3
- D2
- D1
- SD
- 0
- 1
- eMMC
- NAND

### Library data of the parts
R7#2 R8 R77 R81-R84 R87 R97 R99 R100 R102-R104 R106-R119 R122 R123 = 电阻
SW1 = SW_DIP-4_SM: SW 4P SPST DIP 25MA 24V SMT; CLASS: IC; AGILE_PN: 510-77990; MFG_NAME01: DIPTRONICS MANUFACTURING; MFG_PN01: DHN-04-V; CAD_APPROVED: Yes; ROHS: Yes; HEIGHT: 1.65 MM

## Nets that join several sheets
BOOT3.3: 2.POWER (R6#1.2), 9.BOOT (6 pins)
DCDC_3V3: 1.CONNECTOR (J1.112), 7.AUDIO-TFCARD (8 pins)
GND: 1.CONNECTOR (13 pins), 2.POWER (15 pins), 4.CAMERA-RGB (16 pins), 5.USB-RTC-RST (41 pins), 7.AUDIO-TFCARD (6 pins), 8.PCIE-WIFI (28 pins), 9.BOOT (24 pins)
USB_OTG1_VBUS: 1.CONNECTOR (J1.91), 5.USB-RTC-RST (7 pins)
USB_OTG2_VBUS: 1.CONNECTOR (J1.92), 5.USB-RTC-RST (R126.2)
VCC3V3: 2.POWER (7 pins), 4.CAMERA-RGB (5 pins), 5.USB-RTC-RST (22 pins), 8.PCIE-WIFI (12 pins)
VCC5V: 1.CONNECTOR (J1.34 J1.35), 2.POWER (8 pins), 4.CAMERA-RGB (5 pins), 5.USB-RTC-RST (7 pins)
CSI_HSYNC: 1.CONNECTOR (J1.129), 4.CAMERA-RGB (R120.2), 5.USB-RTC-RST (U6.2)
CSI_VSYNC: 1.CONNECTOR (J1.130), 4.CAMERA-RGB (R121.2), 5.USB-RTC-RST (U6.13)
GPIO1_1: 1.CONNECTOR (J1.72), 4.CAMERA-RGB (J12.47)
GPIO1_2: 1.CONNECTOR (J1.73), 4.CAMERA-RGB (J12.49)
GPIO1_3: 1.CONNECTOR (J1.74), 4.CAMERA-RGB (J12.48)
GPIO1_4: 1.CONNECTOR (J1.75), 4.CAMERA-RGB (J12.50)
GPIO1_5: 1.CONNECTOR (J1.76), 4.CAMERA-RGB (R105.1)
GPIO5_IO8: 1.CONNECTOR (J1.108), 8.PCIE-WIFI (R148.1 R149.1)
LCD_DATA0: 1.CONNECTOR (J1.7), 4.CAMERA-RGB (J12.15), 9.BOOT (R97.2)
LCD_DATA1: 1.CONNECTOR (J1.8), 4.CAMERA-RGB (J12.16), 9.BOOT (R7#2.2 R87.1)
LCD_DATA2: 1.CONNECTOR (J1.9), 4.CAMERA-RGB (J12.17), 9.BOOT (R99.2)
LCD_DATA3: 1.CONNECTOR (J1.10), 4.CAMERA-RGB (J12.18), 9.BOOT (R100.2)
LCD_DATA4: 1.CONNECTOR (J1.11), 4.CAMERA-RGB (J12.19), 9.BOOT (R8.2 R84.1)
LCD_DATA5: 1.CONNECTOR (J1.12), 4.CAMERA-RGB (J12.20), 9.BOOT (R102.2 SW1.2)
LCD_DATA6: 1.CONNECTOR (J1.13), 4.CAMERA-RGB (J12.21), 9.BOOT (R103.2 SW1.3)
LCD_DATA7: 1.CONNECTOR (J1.14), 4.CAMERA-RGB (J12.22), 9.BOOT (R104.2 SW1.4)
LCD_DATA8: 1.CONNECTOR (J1.15), 4.CAMERA-RGB (J12.24), 9.BOOT (R106.2)
LCD_DATA9: 1.CONNECTOR (J1.16), 4.CAMERA-RGB (J12.25), 9.BOOT (R107.2)
LCD_DATA10: 1.CONNECTOR (J1.17), 4.CAMERA-RGB (J12.26), 9.BOOT (R108.2)
LCD_DATA11: 1.CONNECTOR (J1.18), 4.CAMERA-RGB (J12.27), 9.BOOT (R109.2 SW1.1)
LCD_DATA12: 1.CONNECTOR (J1.19), 4.CAMERA-RGB (J12.28), 9.BOOT (R110.2)
LCD_DATA13: 1.CONNECTOR (J1.20), 4.CAMERA-RGB (J12.29), 9.BOOT (R111.2)
LCD_DATA14: 1.CONNECTOR (J1.21), 4.CAMERA-RGB (J12.30), 9.BOOT (R112.2)
LCD_DATA15: 1.CONNECTOR (J1.22), 4.CAMERA-RGB (J12.31), 9.BOOT (R113.2)
LCD_DATA16: 1.CONNECTOR (J1.23), 4.CAMERA-RGB (J12.33), 9.BOOT (R114.2)
LCD_DATA17: 1.CONNECTOR (J1.24), 4.CAMERA-RGB (J12.34), 9.BOOT (R115.2)
LCD_DATA18: 1.CONNECTOR (J1.25), 4.CAMERA-RGB (J12.35), 9.BOOT (R116.2)
LCD_DATA19: 1.CONNECTOR (J1.26), 4.CAMERA-RGB (J12.36), 9.BOOT (R117.2)
LCD_DATA20: 1.CONNECTOR (J1.27), 4.CAMERA-RGB (J12.37), 9.BOOT (R118.2)
LCD_DATA21: 1.CONNECTOR (J1.28), 4.CAMERA-RGB (J12.38), 9.BOOT (R119.2)
LCD_DATA22: 1.CONNECTOR (J1.29), 4.CAMERA-RGB (J12.39), 9.BOOT (R122.2)
LCD_DATA23: 1.CONNECTOR (J1.30), 4.CAMERA-RGB (J12.40), 9.BOOT (R123.2)
LCD_DE: 1.CONNECTOR (J1.3), 4.CAMERA-RGB (J12.11)
LCD_HSYNC: 1.CONNECTOR (J1.2), 4.CAMERA-RGB (J12.13)
LCD_PCLK: 1.CONNECTOR (J1.4), 4.CAMERA-RGB (J12.42)
LCD_VSYNC: 1.CONNECTOR (J1.1), 4.CAMERA-RGB (J12.12)
ONOFF: 1.CONNECTOR (J1.110), 5.USB-RTC-RST (R129.2)
PWRON: 1.CONNECTOR (J1.81), 5.USB-RTC-RST (R158.2)
SD1_CLK: 1.CONNECTOR (J1.114), 7.AUDIO-TFCARD (R52.1)
SD1_CMD: 1.CONNECTOR (J1.115), 7.AUDIO-TFCARD (R51.1)
SD1_DATA0: 1.CONNECTOR (J1.119), 7.AUDIO-TFCARD (R54.1)
SD1_DATA1: 1.CONNECTOR (J1.118), 7.AUDIO-TFCARD (R55.1)
SD1_DATA2: 1.CONNECTOR (J1.117), 7.AUDIO-TFCARD (R49.1)
SD1_DATA3: 1.CONNECTOR (J1.116), 7.AUDIO-TFCARD (R50.1)
UART1_RXD: 1.CONNECTOR (J1.69), 6.232-485-CAN-DB (P1.1)
UART1_TXD: 1.CONNECTOR (J1.70), 6.232-485-CAN-DB (P1.2)
USB_OTG_N: 1.CONNECTOR (J1.85), 5.USB-RTC-RST (R29.2)
USB_OTG_P: 1.CONNECTOR (J1.86), 5.USB-RTC-RST (R65.2)
USB_PORT1_N: 5.USB-RTC-RST (U5.1), 8.PCIE-WIFI (U17.2)
USB_PORT1_P: 5.USB-RTC-RST (U5.2), 8.PCIE-WIFI (U17.3)
USB_PORT4_N: 5.USB-RTC-RST (U5.8), 8.PCIE-WIFI (J17.36)
USB_PORT4_P: 5.USB-RTC-RST (U5.9), 8.PCIE-WIFI (J17.38)